# EAGLE design power_board (EAGLE 6.3)

## Sheet 1 of 7: V-AUX
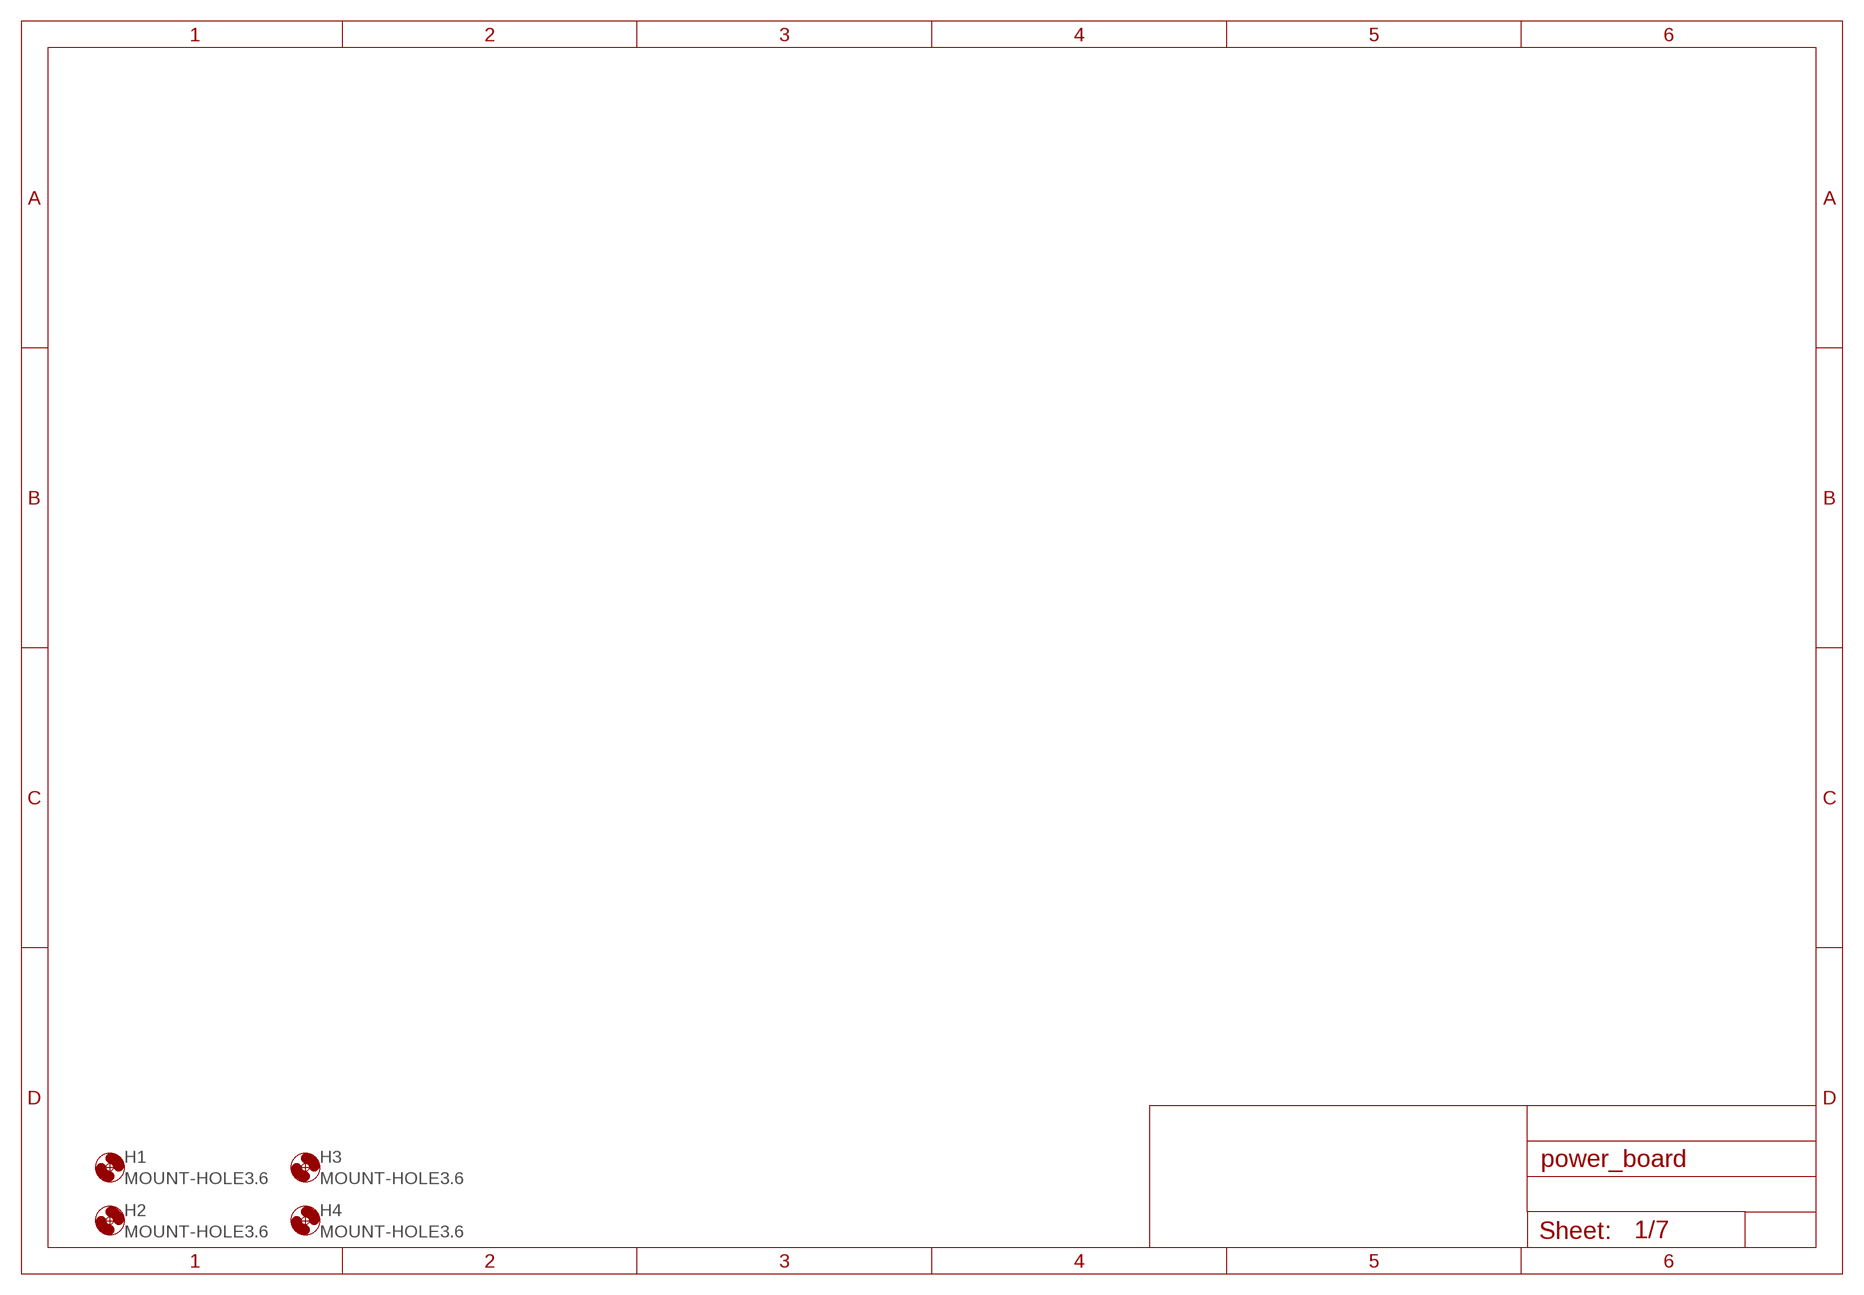
[diagram p0: schematic, sheet 1]

### Parts
H1  MOUNT-HOLE3.6  [3,6]
H2  MOUNT-HOLE3.6  [3,6]
H3  MOUNT-HOLE3.6  [3,6]
H4  MOUNT-HOLE3.6  [3,6]

## Sheet 2 of 7: 4S Li Charger
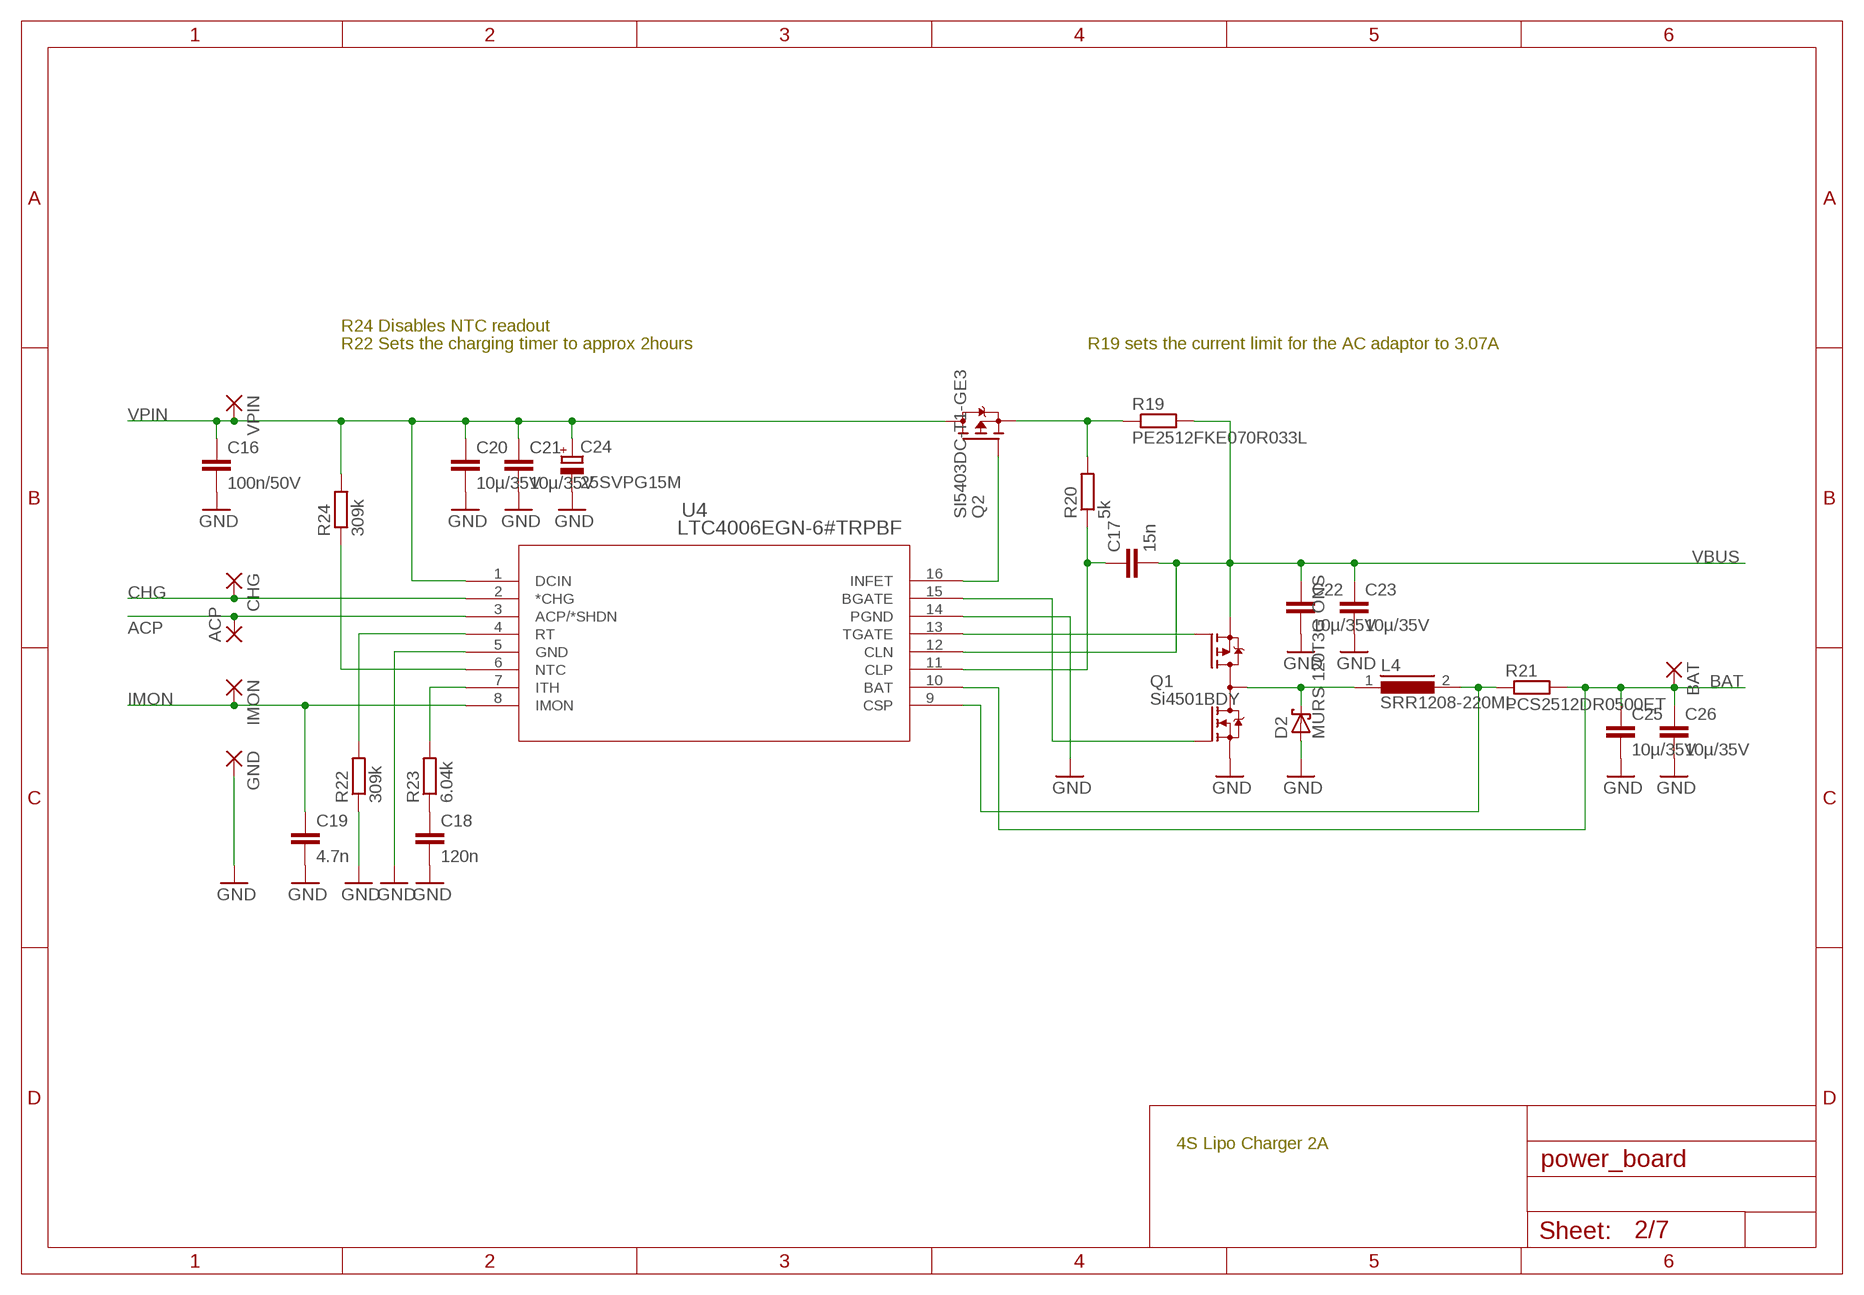
[diagram p1: schematic, sheet 2]

### Parts
ACP  SMD2  [SMD1,27-2,54]
BAT  SMD2  [SMD1,27-2,54]
C16  100n/50V  C-EUC1206  [C1206]
C17  15n  C-EUC0805  [C0805]
C18  120n  C-EUC0805  [C0805]
C19  4.7n  C-EUC0805  [C0805]
C20  10µ/35V  C-EUC1206  [C1206]
C21  10µ/35V  C-EUC1206  [C1206]
C22  10µ/35V  C-EUC1206  [C1206]
C23  10µ/35V  C-EUC1206  [C1206]
C24  25SVPG15M  CPOL-EU153CLV-0505  [153CLV-0505]
C25  10µ/35V  C-EUC1206  [C1206]
C26  10µ/35V  C-EUC1206  [C1206]
CHG  SMD2  [SMD1,27-2,54]
D2  MURS 120T3G ONS  SCHOTTKY-DIODESMD  [SMB]
GND  SMD2  [SMD1,27-2,54]
IMON  SMD2  [SMD1,27-2,54]
L4  SRR1208-220ML  DR127  [DR127]
Q1  Si4501BDY  IRF7389  [SO08-IRF]
Q2  SI5403DC-T1-GE3  [1206-8CHIP-FET]
R19  PE2512FKE070R033L  R-EU_R2512  [R2512]
R20  5k  R-EU_R0805  [R0805]
R21  PCS2512DR0500ET  R-EU_R2512  [R2512]
R22  309k  R-EU_R0805  [R0805]
R23  6.04k  R-EU_R0805  [R0805]
R24  309k  R-EU_R0805  [R0805]
U4  LTC4006EGN-6#TRPBF  [SSOP-16_GN]
VPIN  SMD2  [SMD1,27-2,54]

### Nets
ACP: ACP.1(P) U4.3(ACP/*SHDN)
BAT: BAT.1(P) C25.1 C26.1 R21.2 U4.10(BAT) ; also sheet 7
CHG: CHG.1(P) U4.2(*CHG)
GND: C16.2 C18.2 C19.2 C20.2 C21.2 C22.2 C23.2 C24.- C25.2 C26.2 D2.A GND.1(P) Q1.1(N-S) R22.1 U4.5(GND) U4.14(PGND) ; also sheet 3,4,5,6,7
IMON: C19.1 IMON.1(P) U4.8(IMON)
N$10: Q2.4(G) U4.16(INFET)
N$11: Q2.5(S) R19.1 R20.2
N$12: Q1.4(P-G) U4.13(TGATE)
N$13: Q1.2(N-G) U4.15(BGATE)
N$16: C17.1 R20.1 U4.11(CLP)
N$17: C18.1 R23.1
N$18: D2.C L4.1 Q1.5(D) Q1.6(D) Q1.7(D) Q1.8(D)
N$19: L4.2 R21.1 U4.9(CSP)
N$20: R22.2 U4.4(RT)
N$21: R23.2 U4.7(ITH)
N$23: R24.1 U4.6(NTC)
VBUS: C17.2 C22.1 C23.1 Q1.3(P-S) R19.2 U4.12(CLN) ; also sheet 3,4,5,6
VPIN: C16.1 C20.1 C21.1 C24.+ Q2.1(D) Q2.2(D) Q2.3(D) Q2.6(D) Q2.7(D) Q2.8(D) R24.2 U4.1(DCIN) VPIN.1(P) ; also sheet 7

### Notes on the sheet
- R24 Disables NTC readout
- R22 Sets the charging timer to approx 2hours | R19 sets the current limit for the AC adaptor to 3.07A
- 4S Lipo Charger 2A

## Sheet 3 of 7: D30U Boost
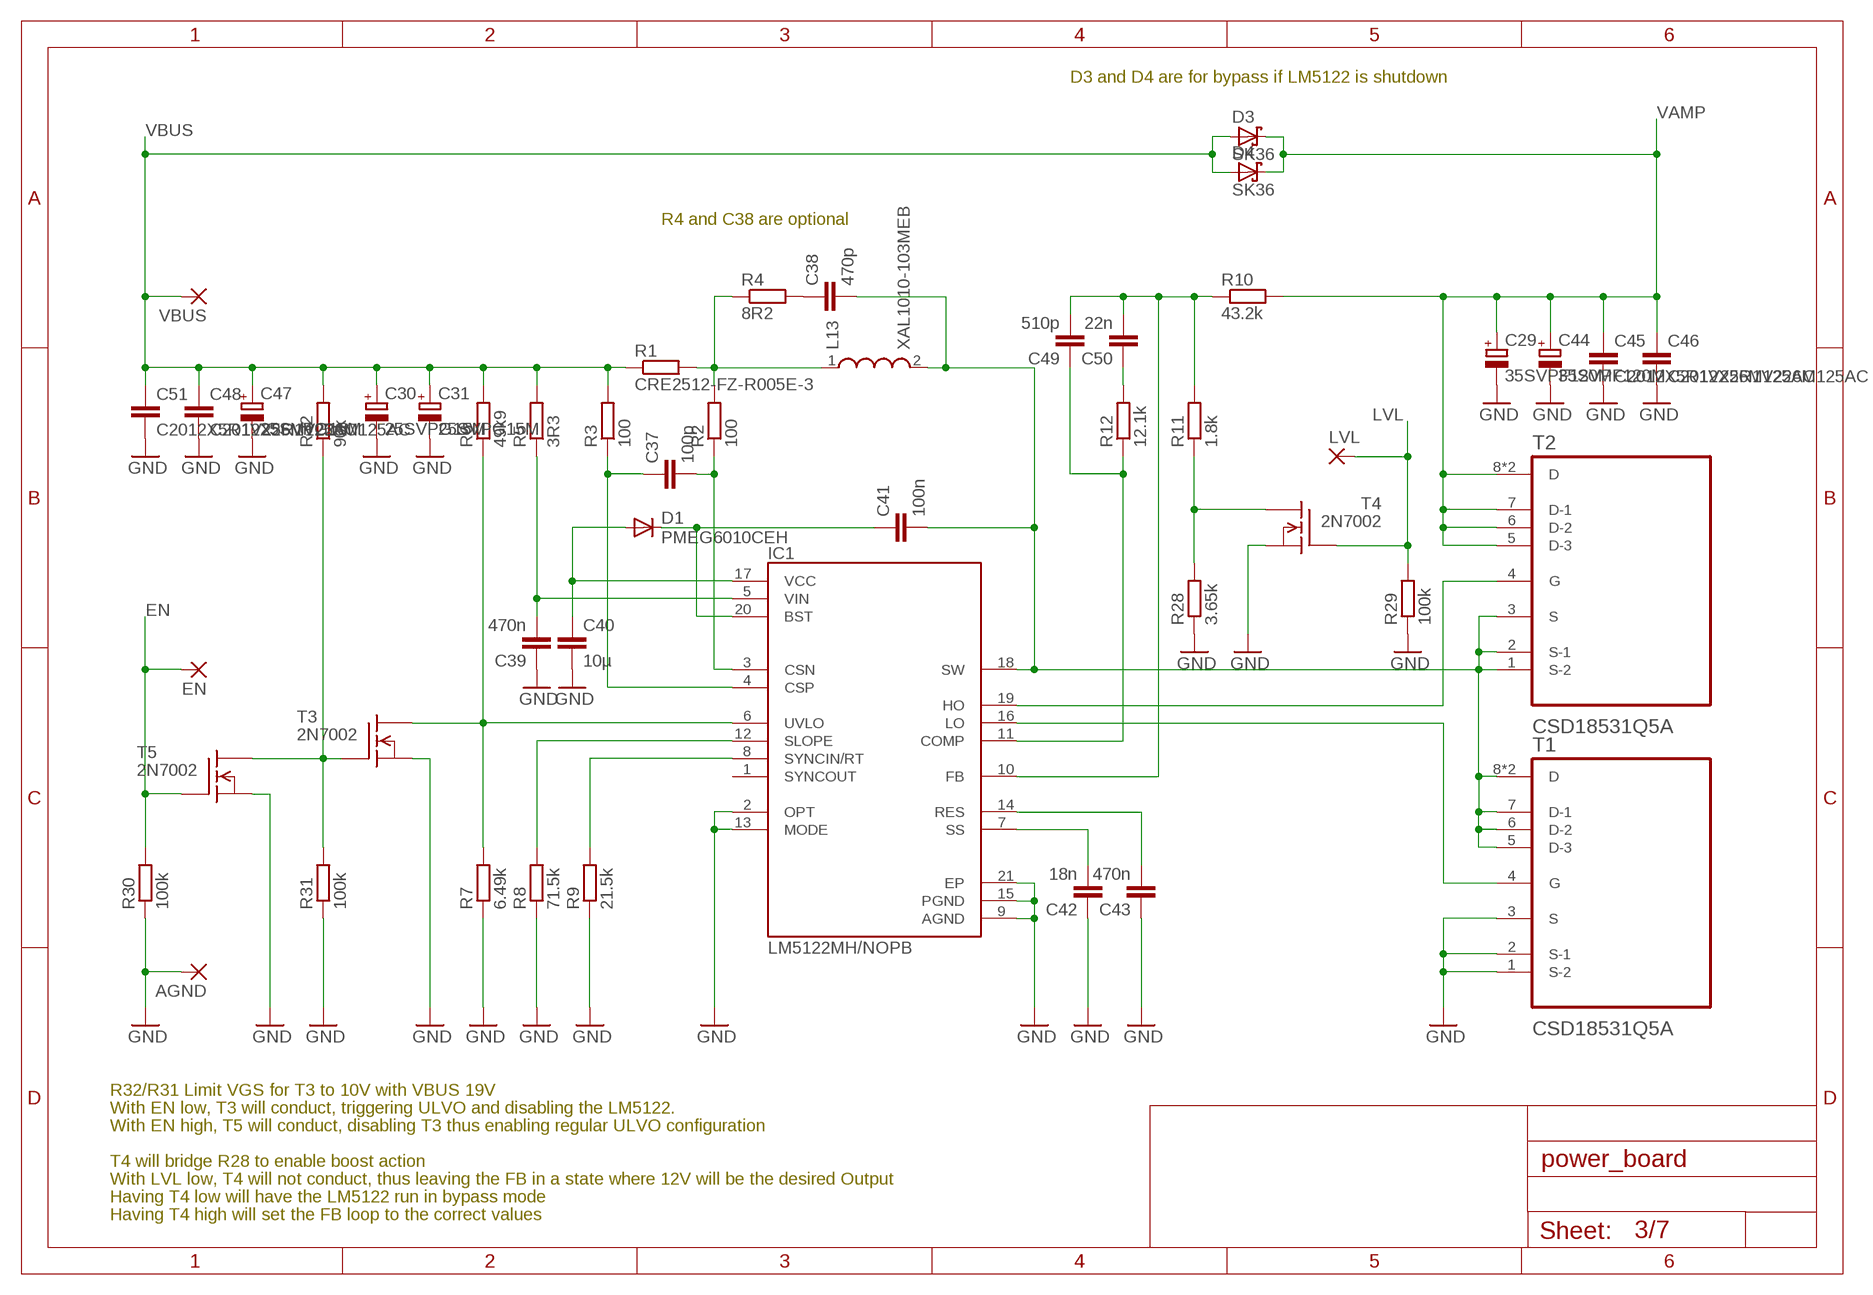
[diagram p2: schematic, sheet 3]

### Parts
AGND  SMD2  [SMD1,27-2,54]
C29  35SVPF120M  CPOL-EU153CLV-1012  [153CLV-1012]
C30  25SVPG15M  CPOL-EU153CLV-0505  [153CLV-0505]
C31  25SVPG15M  CPOL-EU153CLV-0505  [153CLV-0505]
C37  100p  C-EUC0805  [C0805]
C38  470p  C-EUC0805  [C0805]
C39  470n  C-EUC0805  [C0805]
C40  10µ  C-EUC1206  [C1206]
C41  100n  C-EUC0805  [C0805]
C42  18n  C-EUC0805  [C0805]
C43  470n  C-EUC0805  [C0805]
C44  35SVPF120M  CPOL-EU153CLV-1012  [153CLV-1012]
C45  C2012X5R1V226M125AC  C-EUC0805  [C0805]
C46  C2012X5R1V226M125AC  C-EUC0805  [C0805]
C47  25SVPG15M  CPOL-EU153CLV-0505  [153CLV-0505]
C48  C2012X5R1V226M125AC  C-EUC0805  [C0805]
C49  510p  C-EUC0805  [C0805]
C50  22n  C-EUC0805  [C0805]
C51  C2012X5R1V226M125AC  C-EUC0805  [C0805]
D1  PMEG6010CEH  DIODE-SOD323-W  [SOD323-W]
D3  SK36  SCHOTTKY-DIODESMD  [SMB]
D4  SK36  SCHOTTKY-DIODESMD  [SMB]
EN  SMD2  [SMD1,27-2,54]
IC1  LM5122MH/NOPB  [SOP65P640X110-21N]
L13  XAL1010-103MEB  XAL1010-472MED  [INDC110100X1000N]
LVL  SMD2  [SMD1,27-2,54]
R1  CRE2512-FZ-R005E-3  R-EU_R2512  [R2512]
R2  100  R-EU_R0805  [R0805]
R3  100  R-EU_R0805  [R0805]
R4  8R2  R-EU_M0805  [M0805]
R5  3R3  R-EU_R0805  [R0805]
R6  49k9  R-EU_R0805  [R0805]
R7  6.49k  R-EU_R0805  [R0805]
R8  71.5k  R-EU_R0805  [R0805]
R9  21.5k  R-EU_R0805  [R0805]
R10  43.2k  R-EU_R0805  [R0805]
R11  1.8k  R-EU_R0805  [R0805]
R12  12.1k  R-EU_R0805  [R0805]
R28  3.65k  R-EU_R0805  [R0805]
R29  100k  R-EU_R0805  [R0805]
R30  100k  R-EU_R0805  [R0805]
R31  100k  R-EU_R0805  [R0805]
R32  90k  R-EU_R0805  [R0805]
T1  CSD18531Q5A  [MOSFET_CSD19531Q5A]
T2  CSD18531Q5A  [MOSFET_CSD19531Q5A]
T3  2N7002  [SOT23]
T4  2N7002  [SOT23]
T5  2N7002  [SOT23]
VBUS  SMD2  [SMD1,27-2,54]

### Nets
EN: EN.1(P) R30.2 T5.1(G) ; also sheet 4,6,7
GND: AGND.1(P) C29.- C30.- C31.- C39.1 C40.2 C42.1 C43.1 C44.- C45.2 C46.2 C47.- C48.2 C51.2 IC1.2(OPT) IC1.9(AGND) IC1.13(MODE) IC1.15(PGND) IC1.21(EP) R7.1 R8.1 R9.1 R28.1 R29.1 R30.1 R31.1 T1.1(S-2) T1.2(S-1) T1.3(S) T3.2(S) T4.2(S) T5.2(S) ; also sheet 2,4,5,6,7
LVL: LVL.1(P) R29.2 T4.1(G) ; also sheet 7
N$22: R11.1 R28.2 T4.3(D)
N$25: R31.2 R32.1 T3.1(G) T5.3(D)
N$31: C38.2 C41.2 IC1.18(SW) L13.2 T1.5(D-3) T1.6(D-2) T1.7(D-1) T1.8(D) T1.9(D) T2.1(S-2) T2.2(S-1) T2.3(S)
N$32: C41.1 D1.C IC1.20(BST)
N$34: L13.1 R1.2 R2.2 R4.1
N$35: C38.1 R4.2
N$37: C37.2 IC1.3(CSN) R2.1
N$38: C37.1 IC1.4(CSP) R3.1
N$39: IC1.19(HO) T2.4(G)
N$40: IC1.16(LO) T1.4(G)
N$41: C39.2 IC1.5(VIN) R5.1
N$42: C40.1 D1.A IC1.17(VCC)
N$43: IC1.6(UVLO) R6.1 R7.2 T3.3(D)
N$44: IC1.12(SLOPE) R8.2
N$45: IC1.8(SYNCIN/RT) R9.2
N$46: C42.2 IC1.7(SS)
N$47: C43.2 IC1.14(RES)
N$48: C49.2 C50.2 IC1.10(FB) R10.1 R11.2
N$49: C50.1 R12.2
N$50: C49.1 IC1.11(COMP) R12.1
VAMP: C29.+ C44.+ C45.1 C46.1 D3.C D4.C R10.2 T2.5(D-3) T2.6(D-2) T2.7(D-1) T2.8(D) T2.9(D) ; also sheet 7
VBUS: C30.+ C31.+ C47.+ C48.1 C51.1 D3.A D4.A R1.1 R3.2 R5.2 R6.2 R32.2 VBUS.1(P) ; also sheet 2,4,5,6
Unconnected: IC1.1(SYNCOUT)

### Notes on the sheet
- D3 and D4 are for bypass if LM5122 is shutdown
- R4 and C38 are optional
- R32/R31 Limit VGS for T3 to 10V with VBUS 19V
- With EN low, T3 will conduct, triggering ULVO and disabling the LM5122.
- With EN high, T5 will conduct, disabling T3 thus enabling regular ULVO configuration
- T4 will bridge R28 to enable boost action
- With LVL low, T4 will not conduct, thus leaving the FB in a state where 12V will be the desired Output
- Having T4 low will have the LM5122 run in bypass mode
- Having T4 high will set the FB loop to the correct values

## Sheet 4 of 7: A75U Buck
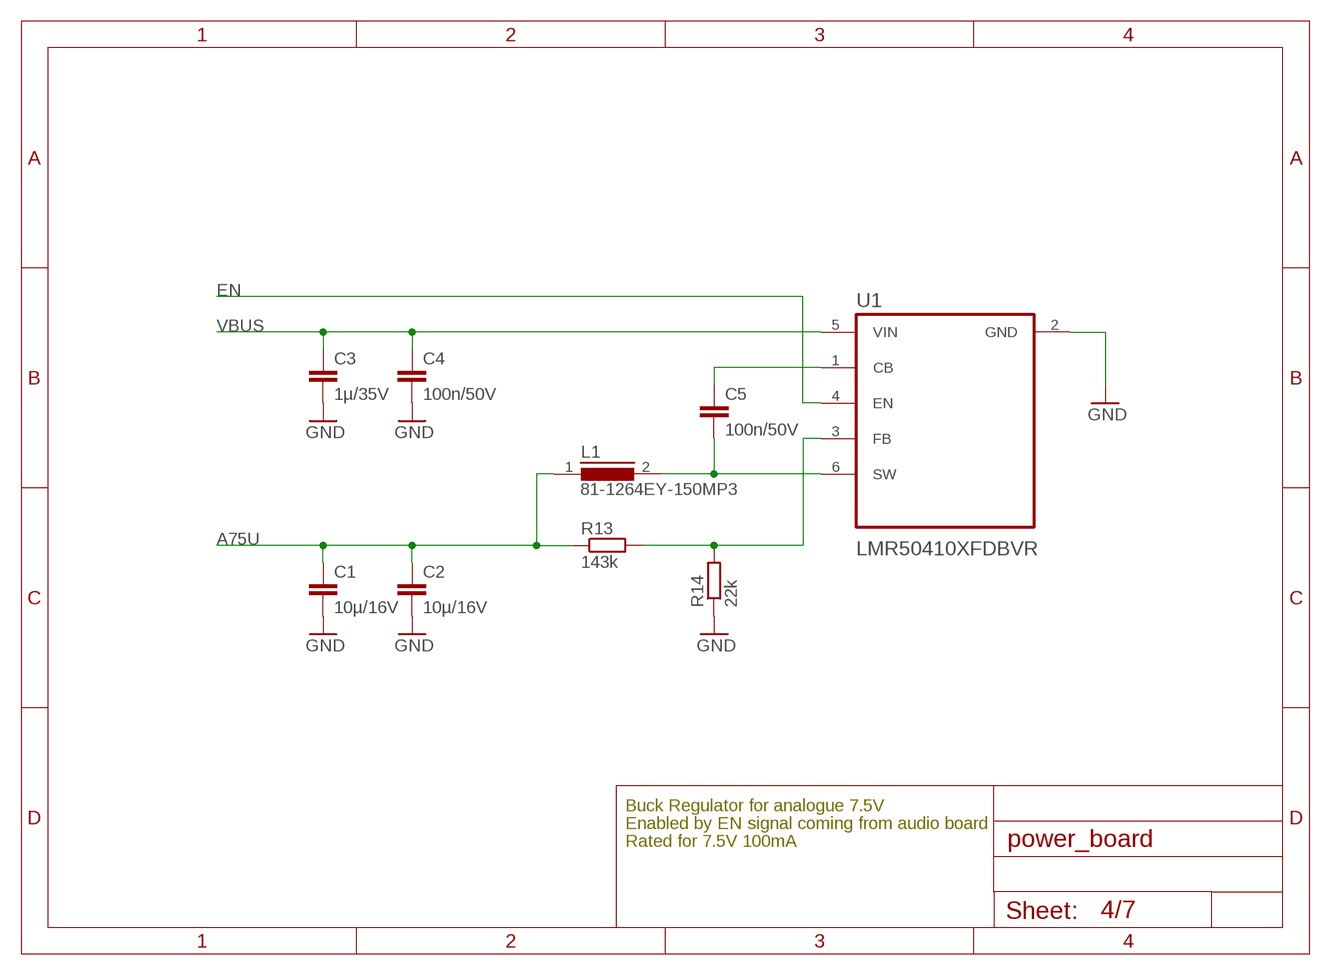
[diagram p3: schematic, sheet 4]

### Parts
C1  10µ/16V  C-EUC1206  [C1206]
C2  10µ/16V  C-EUC1206  [C1206]
C3  1µ/35V  C-EUC1206  [C1206]
C4  100n/50V  C-EUC1206  [C1206]
C5  100n/50V  C-EUC1206  [C1206]
L1  81-1264EY-150MP3  DR73  [DR73]
R13  143k  R-EU_M0805  [M0805]
R14  22k  R-EU_M0805  [M0805]
U1  LMR50410XFDBVR  TPS560430YDBVT  [SOT95P280X145-6N]

### Nets
A75U: C1.1 C2.1 L1.1 R13.1 ; also sheet 7
EN: U1.4(EN) ; also sheet 3,6,7
GND: C1.2 C2.2 C3.2 C4.2 R14.1 U1.2(GND) ; also sheet 2,3,5,6,7
N$1: C5.1 U1.1(CB)
N$2: C5.2 L1.2 U1.6(SW)
N$3: R13.2 R14.2 U1.3(FB)
VBUS: C3.1 C4.1 U1.5(VIN) ; also sheet 2,3,5,6

### Notes on the sheet
- Buck Regulator for analogue 7.5V
- Enabled by EN signal coming from audio board
- Rated for 7.5V 100mA

## Sheet 5 of 7: D33U Buck
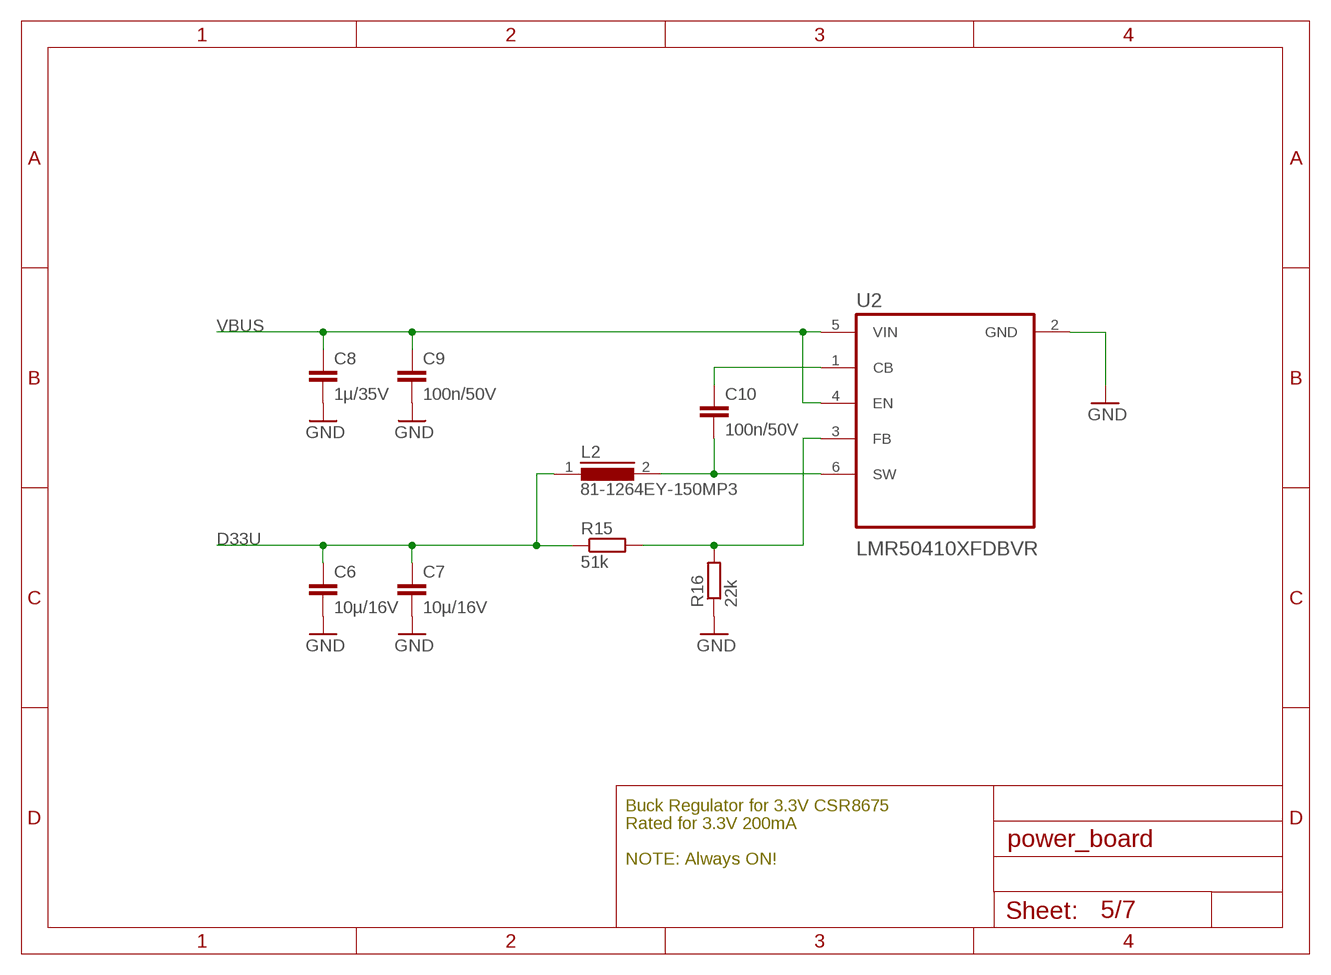
[diagram p4: schematic, sheet 5]

### Parts
C6  10µ/16V  C-EUC1206  [C1206]
C7  10µ/16V  C-EUC1206  [C1206]
C8  1µ/35V  C-EUC1206  [C1206]
C9  100n/50V  C-EUC1206  [C1206]
C10  100n/50V  C-EUC1206  [C1206]
L2  81-1264EY-150MP3  DR73  [DR73]
R15  51k  R-EU_M0805  [M0805]
R16  22k  R-EU_M0805  [M0805]
U2  LMR50410XFDBVR  TPS560430YDBVT  [SOT95P280X145-6N]

### Nets
D33U: C6.1 C7.1 L2.1 R15.1 ; also sheet 7
GND: C6.2 C7.2 C8.2 C9.2 R16.1 U2.2(GND) ; also sheet 2,3,4,6,7
N$4: C10.1 U2.1(CB)
N$5: C10.2 L2.2 U2.6(SW)
N$6: R15.2 R16.2 U2.3(FB)
VBUS: C8.1 C9.1 U2.4(EN) U2.5(VIN) ; also sheet 2,3,4,6

### Notes on the sheet
- Buck Regulator for 3.3V CSR8675
- Rated for 3.3V 200mA
- NOTE: Always ON!

## Sheet 6 of 7: D120U Buck
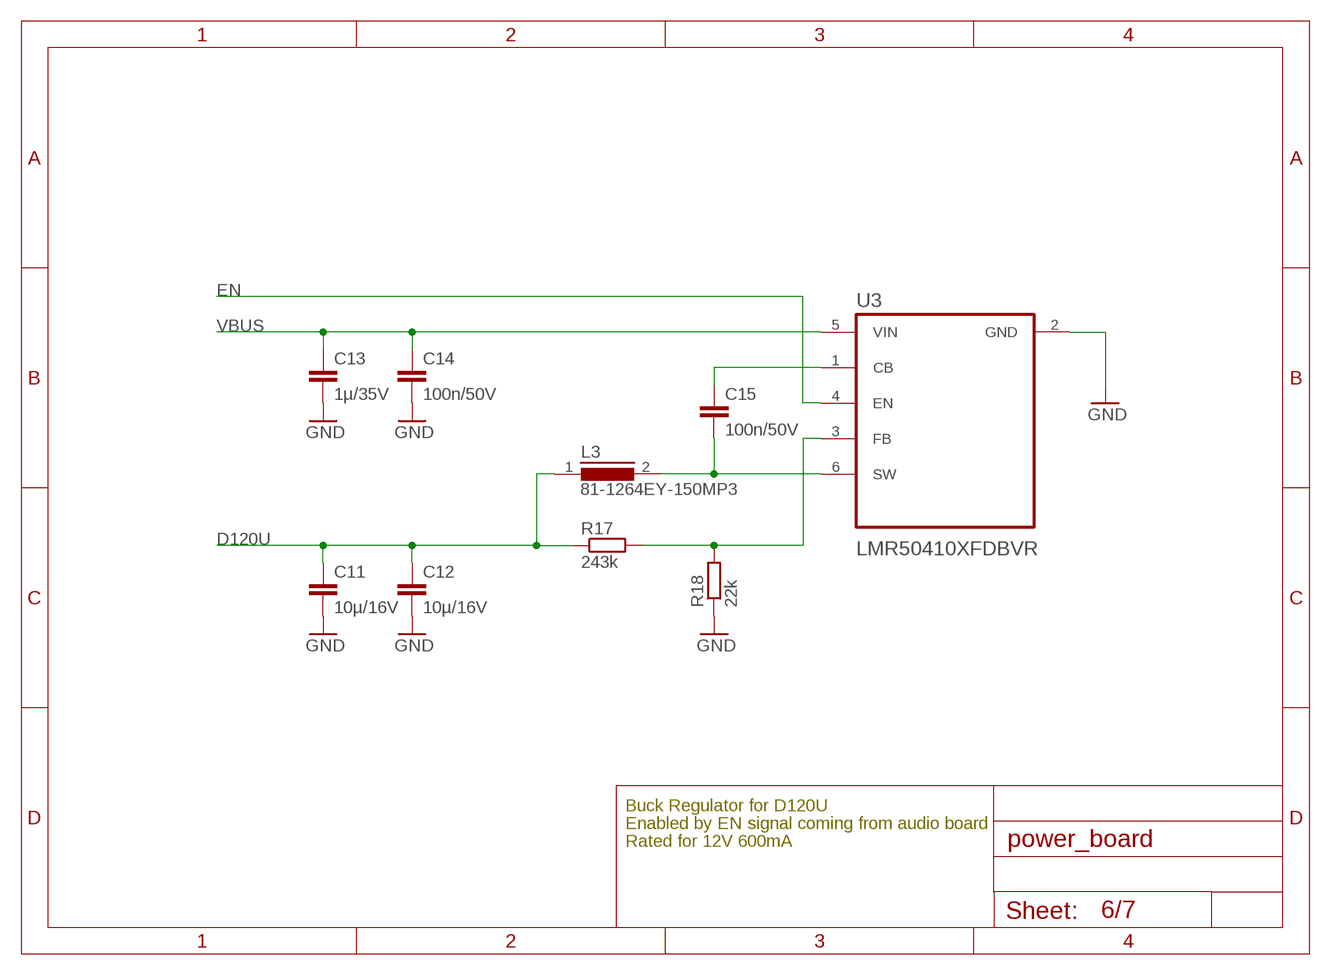
[diagram p5: schematic, sheet 6]

### Parts
C11  10µ/16V  C-EUC1206  [C1206]
C12  10µ/16V  C-EUC1206  [C1206]
C13  1µ/35V  C-EUC1206  [C1206]
C14  100n/50V  C-EUC1206  [C1206]
C15  100n/50V  C-EUC1206  [C1206]
L3  81-1264EY-150MP3  DR73  [DR73]
R17  243k  R-EU_M0805  [M0805]
R18  22k  R-EU_M0805  [M0805]
U3  LMR50410XFDBVR  TPS560430YDBVT  [SOT95P280X145-6N]

### Nets
D120U: C11.1 C12.1 L3.1 R17.1 ; also sheet 7
EN: U3.4(EN) ; also sheet 3,4,7
GND: C11.2 C12.2 C13.2 C14.2 R18.1 U3.2(GND) ; also sheet 2,3,4,5,7
N$7: C15.1 U3.1(CB)
N$8: C15.2 L3.2 U3.6(SW)
N$9: R17.2 R18.2 U3.3(FB)
VBUS: C13.1 C14.1 U3.5(VIN) ; also sheet 2,3,4,5

### Notes on the sheet
- Buck Regulator for D120U
- Enabled by EN signal coming from audio board
- Rated for 12V 600mA

## Sheet 7 of 7
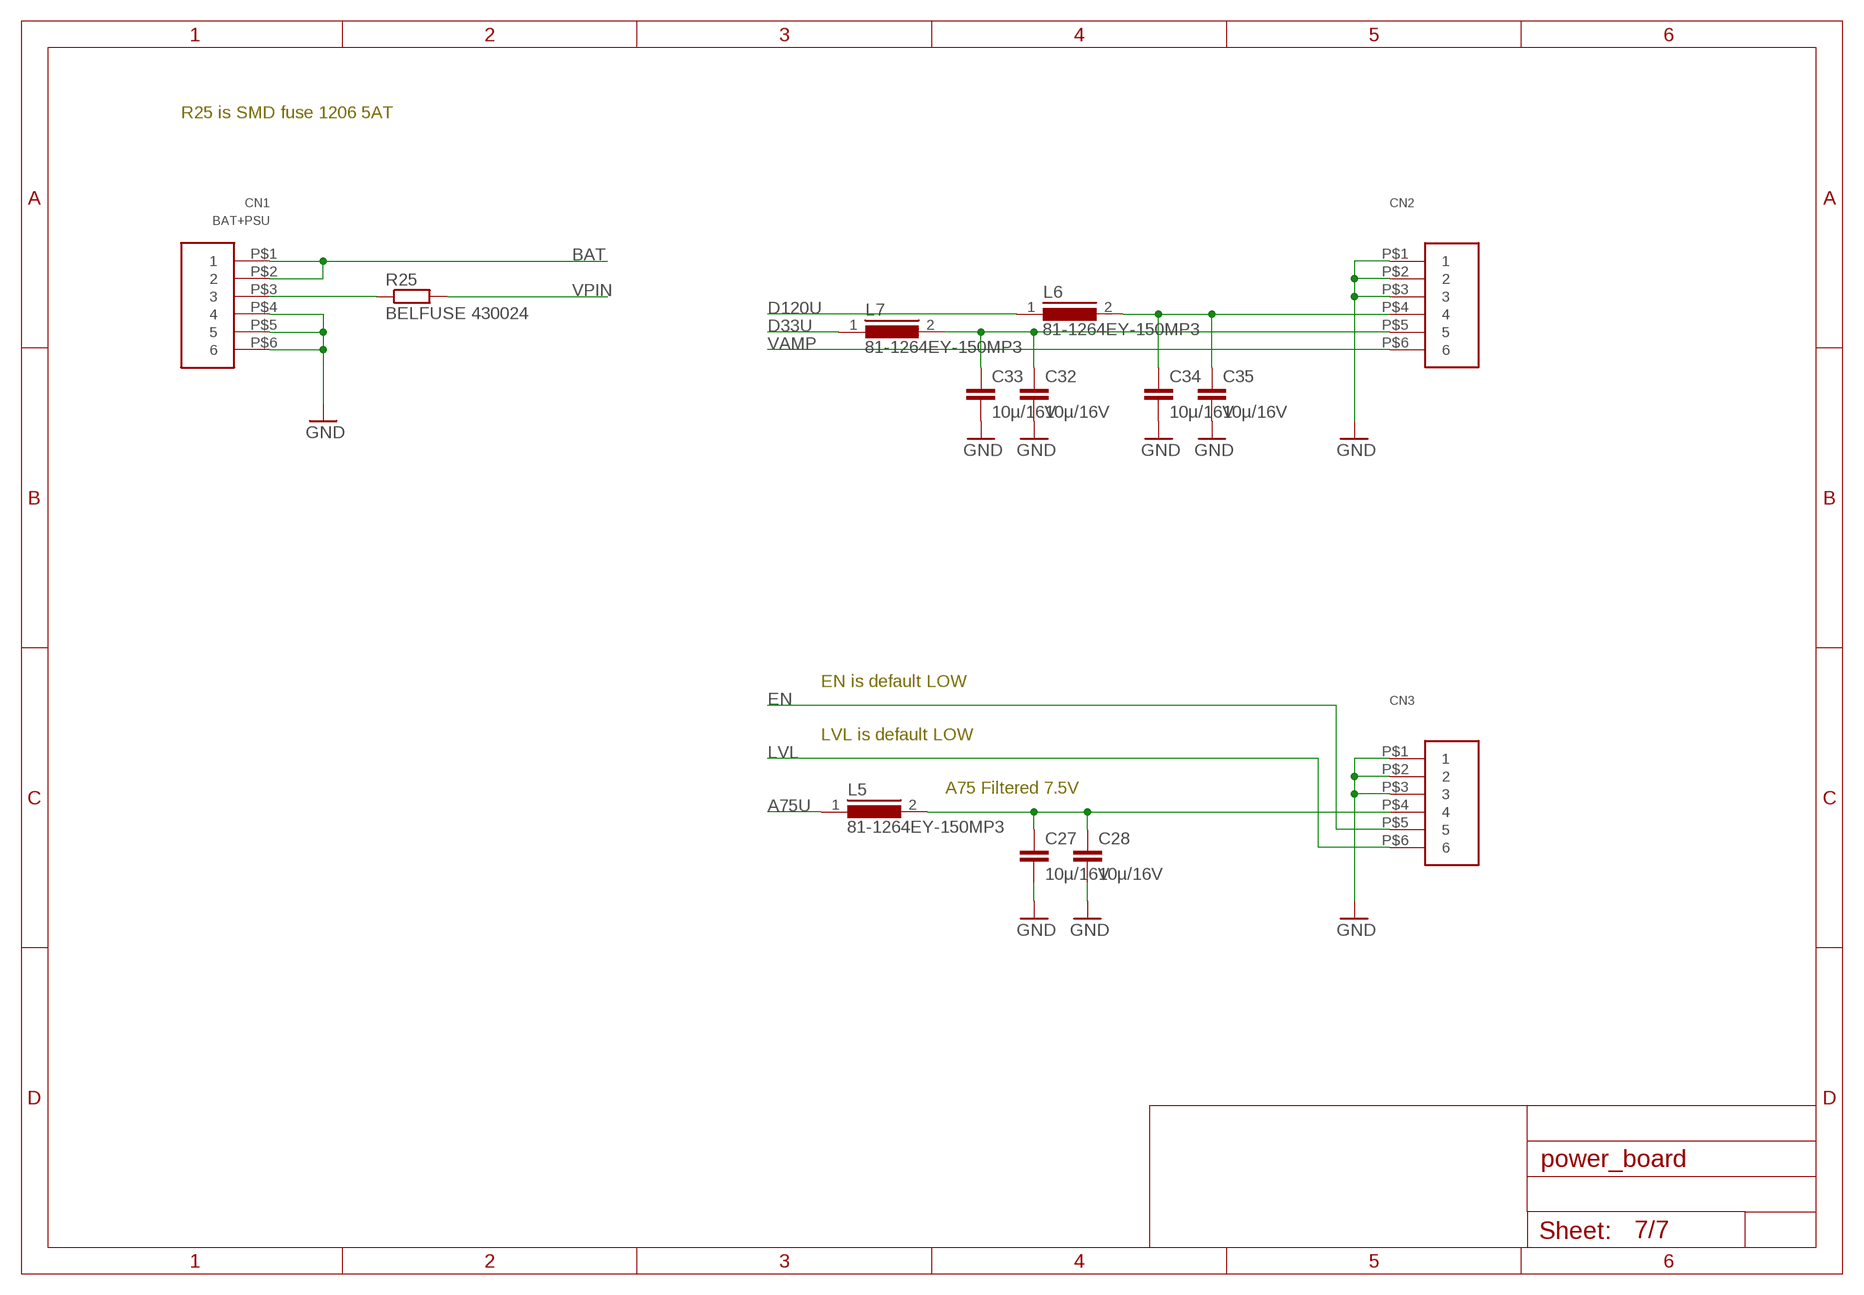
[diagram p6: schematic, sheet 7]

### Parts
C27  10µ/16V  C-EUC1206  [C1206]
C28  10µ/16V  C-EUC1206  [C1206]
C32  10µ/16V  C-EUC1206  [C1206]
C33  10µ/16V  C-EUC1206  [C1206]
C34  10µ/16V  C-EUC1206  [C1206]
C35  10µ/16V  C-EUC1206  [C1206]
CN1  BAT+PSU  39-30-1060_BLANK  [5569_6P]
CN2  39-30-1060_BLANK  [5569_6P]
CN3  39-30-1060_BLANK  [5569_6P]
L5  81-1264EY-150MP3  DR73  [DR73]
L6  81-1264EY-150MP3  DR73  [DR73]
L7  81-1264EY-150MP3  DR73  [DR73]
R25  BELFUSE 430024  R-EU_R1206W  [R1206W]

### Nets
A75U: L5.1 ; also sheet 4
BAT: CN1.P$1 CN1.P$2 ; also sheet 2
D33U: L7.1 ; also sheet 5
D120U: L6.1 ; also sheet 6
EN: CN3.P$5 ; also sheet 3,4,6
GND: C27.2 C28.2 C32.2 C33.2 C34.2 C35.2 CN1.P$4 CN1.P$5 CN1.P$6 CN2.P$1 CN2.P$2 CN2.P$3 CN3.P$1 CN3.P$2 CN3.P$3 ; also sheet 2,3,4,5,6
LVL: CN3.P$6 ; also sheet 3
N$14: CN1.P$3 R25.1
N$15: C27.1 C28.1 CN3.P$4 L5.2
N$24: C34.1 C35.1 CN2.P$4 L6.2
N$26: C32.1 C33.1 CN2.P$5 L7.2
VAMP: CN2.P$6 ; also sheet 3
VPIN: R25.2 ; also sheet 2

### Notes on the sheet
- R25 is SMD fuse 1206 5AT
- EN is default LOW
- LVL is default LOW
- A75 Filtered 7.5V

## Library data of the parts
ACP AGND BAT CHG EN GND IMON LVL VBUS VPIN = wirepad:SMD2: SMD PAD
C1-C23 C25-C28 C32-C35 C37-C43 C45 C46 C48-C51 = rcl:C-EU: CAPACITOR, European symbol
C24 C29-C31 C44 C47 = rcl:CPOL-EU: POLARIZED CAPACITOR, European symbol
CN1-CN3 = molex-con-39301060:39-30-1060_BLANK
D1 = diode:DIODE-: DIODE
D2-D4 = diode:SCHOTTKY-DIODE: Schottky Diode
H1-H4 = holes:MOUNT-HOLE: MOUNTING HOLE with drill center marker
IC1 = LM5122MH_NOPB:LM5122MH/NOPB: 3-65V Wide Vin, Current Mode Synchronous Boost Controller with Multiphase Capability Check prices <https://pricing.snapeda.com/search/part/LM5122MH/NOPB/?ref=eda>; AVAILABILITY: Good; DESCRIPTION: 3-65V Wide Vin, Current Mode Synchronous Boost Controller with Multiphase Capability 20-HTSSOP -40 to 125; MF: Texas Instruments; MP: LM5122MH/NOPB; PACKAGE: HTSSOP-20 Texas Instruments; PRICE: None; PURCHASE-URL: https://pricing.snapeda.com/search/part/LM5122MH/NOPB/?ref=eda
L1-L3 L5-L7 = inductors:DR73: High Power Density, High Efficiency, Shielded Inductors Source: coiltronics_dr_series.pdf
L4 = inductors:DR127: High Power Density, High Efficiency, Shielded Inductors Source: coiltronics_dr_series.pdf
L13 = XAL1010-472MED:XAL1010-472MED: Power inductor, shielded, 20% tol, SMT, RoHS, halogen f Check prices <https://pricing.snapeda.com/parts/XAL1010-472MED/Coilcraft/view-part?ref=eda>; AVAILABILITY: Warning; DESCRIPTION: Power inductor, shielded, 20% tol, SMT, RoHS, halogen f; MF: Coilcraft; MP: XAL1010-472MED; PACKAGE: None; PRICE: None; PURCHASE-URL: https://pricing.snapeda.com/search/part/XAL1010-472MED/?ref=eda
Q1 = transistor-fet:IRF7389: Complimentary Half Bridge HEXFET Power MOSFET Source: http://www.irf.com/product-info/datasheets/data/irf7389.pdf
Q2 = transistor-fet:SI5403DC-T1-GE3
R1-R25 R28-R32 = rcl:R-EU_: RESISTOR, European symbol
T1 T2 = CSD18531Q5A:CSD18531Q5A: Check prices <https://pricing.snapeda.com/search/part/CSD18531Q5A/?ref=eda>; AVAILABILITY: Good; DESCRIPTION: 60V, N ch NexFET MOSFET, single SON5x6, 4.6mOhm 8-VSONP -55 to 150; MF: Texas Instruments; MP: CSD18531Q5A; PACKAGE: VSONP-8 Texas Instruments; PRICE: None; PURCHASE-URL: https://pricing.snapeda.com/search/part/CSD18531Q5A/?ref=eda
T3-T5 = parts:2N7002: N-CHANNEL ENHANCEMENT MODE FIELD EFFECT TRANSISTOR
U1-U3 = TPS560430YDBVT:TPS560430YDBVT: Check prices <https://pricing.snapeda.com/parts/TPS560430YDBVT/Texas%20Instruments/view-part?ref=eda>; AVAILABILITY: Good; DESCRIPTION: SIMPLE SWITCHER 36-V, 600-mA Buck Regulator With High-Efficiency Sleep Mode 6-SOT-23 -40 to 125; MF: Texas Instruments; MP: TPS560430YDBVT; PACKAGE: SOT-23-6 Texas Instruments; PRICE: None; PURCHASE-URL: https://pricing.snapeda.com/search/part/TPS560430YDBVT/?ref=eda
U4 = LTC4006EGN-6_TRPBF:LTC4006EGN-6#TRPBF: Check prices <https://pricing.snapeda.com/parts/LTC4006EGN-6%23TRPBF/Analog%20Devices/view-part?ref=eda>; AVAILABILITY: Warning; DESCRIPTION: Battery Charger Li-Ion 4000mA 8.4V 16-Pin SSOP N T/R; MF: Analog Devices; MP: LTC4006EGN-6#TRPBF; PACKAGE: SSOP -16 Analog Devices; PRICE: None

## Board
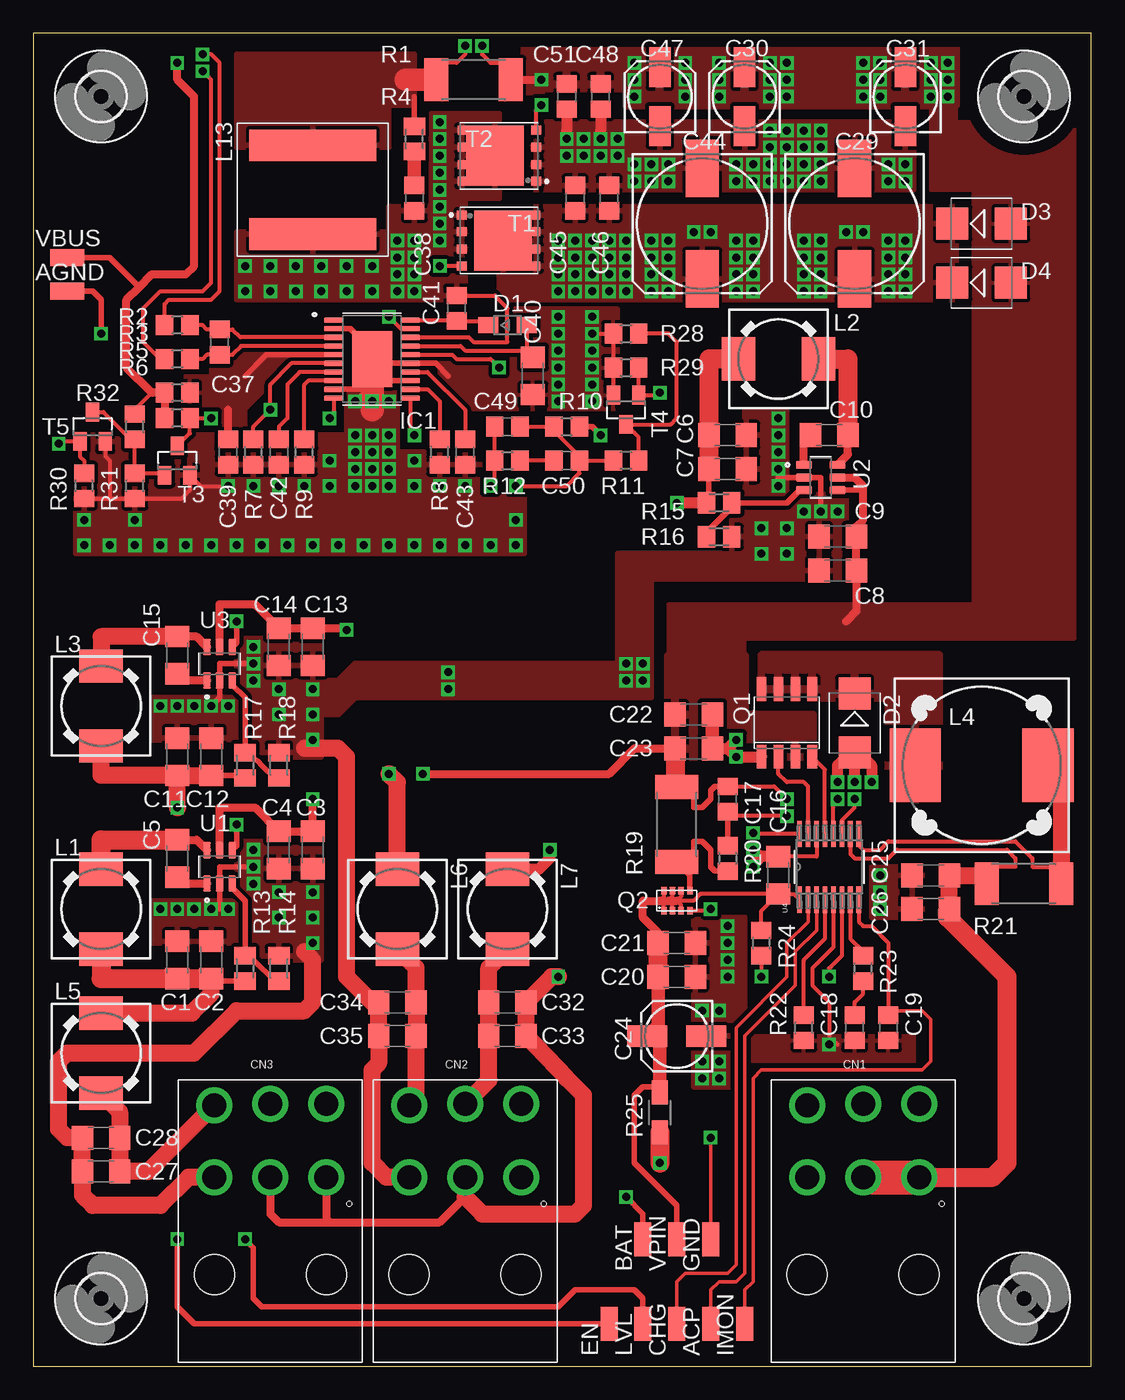
[diagram p7: board, top side]
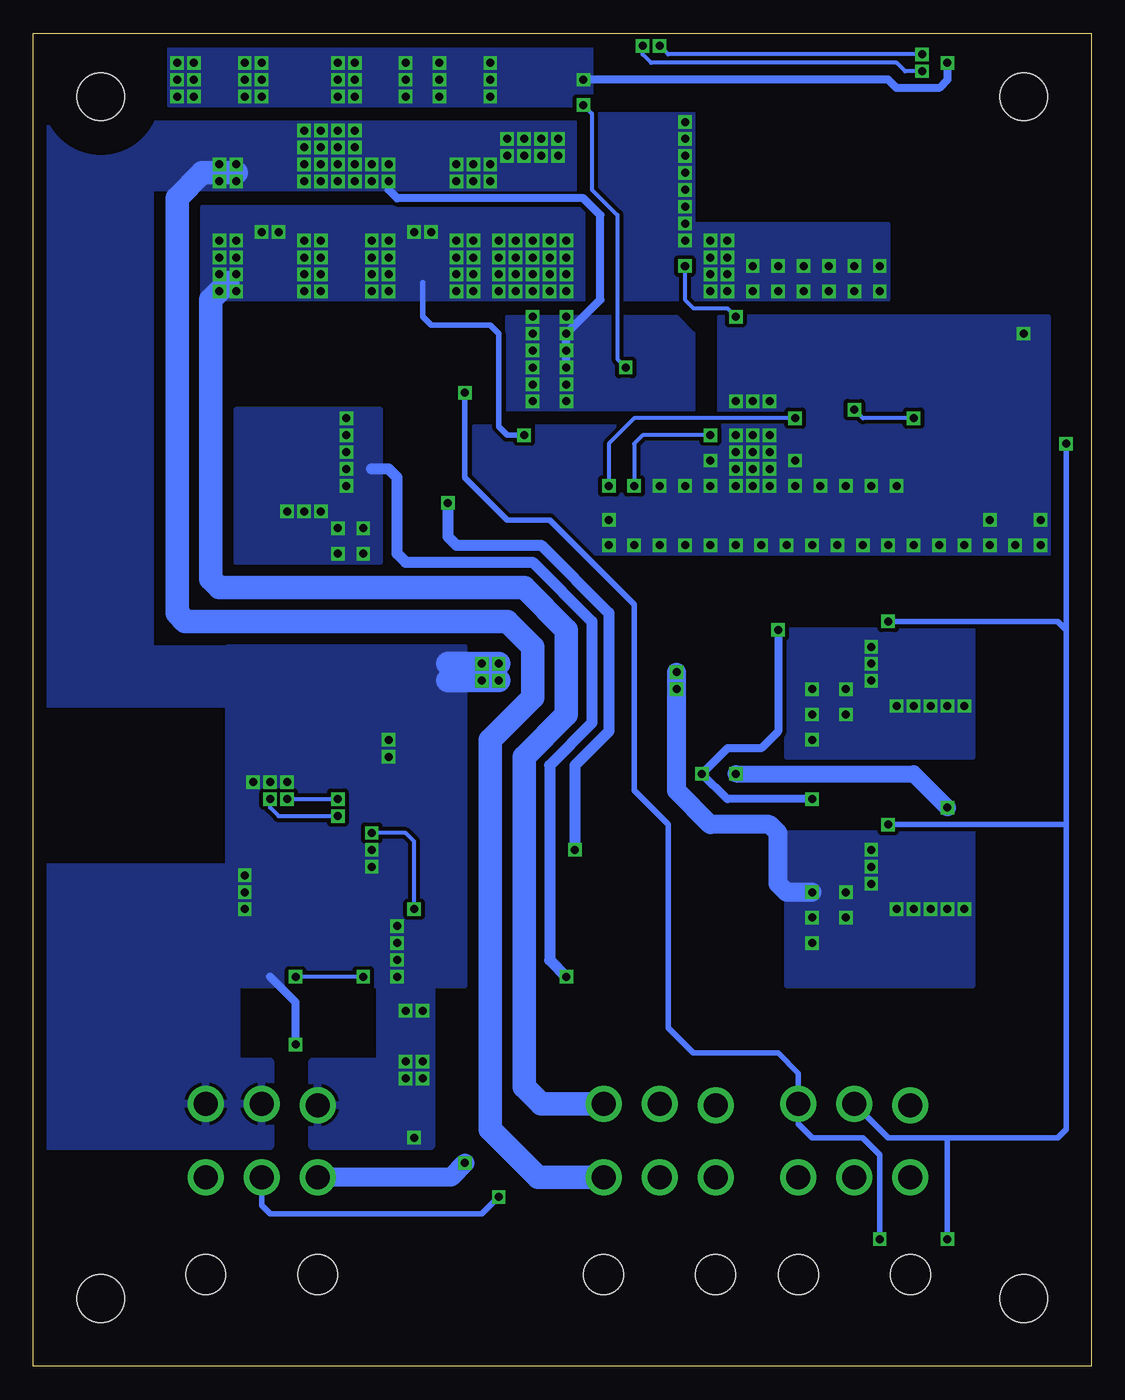
[diagram p8: board, bottom side, seen from below]

Size 79.36 x 100 mm. Coordinates in mm from the lower left corner, seen from the top.
Outline: 0,0 79.36,0 79.36,100 0,100 0,0
Copper layers (1*16): Top 0.035mm / dielectric 1.5mm / Bottom 0.035mm
Design rules "default": minimum track width 10mil, minimum drill 24mil, track to track 8mil, track to pad 8mil, pad to pad 8mil, via to via 8mil, smd to smd 8mil, copper to edge 40mil, drill to drill 8mil, minimum pad ring 10mil, minimum via ring 8mil, stop-mask expansion 4mil, vias tented up to drill 0mil, thermal gap 10mil

### Footprints (pad centres in the part's own frame; a part is rotated, then mirrored left to right if it is on the bottom)
SMD1,27-2,54 = smd 1.27 x 2.54: 1 0,0
C1206 = smd 1.6 x 1.8: 1 -1.4,0; 2 1.4,0
C0805 = smd 1.3 x 1.5: 1 -0.95,0; 2 0.95,0
153CLV-0505 = smd 3 x 1.6: + 2.2,0; - -2.2,0
153CLV-1012 = smd 4.3 x 2.5: + 4.15,0; - -4.15,0
5569_6P = drill 1.8: P$1 4.2,-5.5; P$2 0,-5.5; P$3 -4.2,-5.5; P$4 -4.2,-0.1; P$5 0,0; P$6 4.2,0 | hole 3: 4.2,-12.8; -4.2,-12.8
SOD323-W = smd 1.5 x 1.2: A 1.45,0; C -1.45,0
SMB = smd 2.4 x 2.4: A 2.2,0; C -2.2,0
3,6 = hole 3.6: 0,0
SOP65P640X110-21N = smd 1.44 x 0.41: 1 -2.885,2.925; 2 -2.885,2.275; 3 -2.885,1.625; 4 -2.885,0.975; 5 -2.885,0.325; 6 -2.885,-0.325; 7 -2.885,-0.975; 8 -2.885,-1.625; 9 -2.885,-2.275; 10 -2.885,-2.925; 11 2.885,-2.925; 12 2.885,-2.275; 13 2.885,-1.625; 14 2.885,-0.975; 15 2.885,-0.325; 16 2.885,0.325; 17 2.885,0.975; 18 2.885,1.625; 19 2.885,2.275; 20 2.885,2.925 | smd 3 x 4.2: 21 0,0
DR73 = smd 2.5 x 3.25: 1 -3,0; 2 3,0
DR127 = smd 3.85 x 5.5: 1 -4.975,0; 2 4.975,0
INDC110100X1000N = smd 2.38 x 9.51: 1 -3.325,0; 2 3.325,0
SO08-IRF = smd 0.72 x 1.78: 1 -1.905,-2.543; 2 -0.635,-2.543; 3 0.635,-2.543; 4 1.905,-2.543; 5 1.905,2.543; 6 0.635,2.543; 7 -0.635,2.543; 8 -1.905,2.543
1206-8CHIP-FET = smd 0.406 x 0.56: 1 -0.975,-0.737; 2 -0.325,-0.737; 3 0.325,-0.737; 4 0.975,-0.737; 5 0.975,0.737; 6 0.325,0.737; 7 -0.325,0.737; 8 -0.975,0.737
R2512 = smd 1.8 x 3.2: 1 -2.8,0; 2 2.8,0
R0805 = smd 1.3 x 1.5: 1 -0.95,0; 2 0.95,0
M0805 = smd 1.3 x 1.6: 1 -0.95,0; 2 0.95,0
R1206W = smd 1.8 x 1.2: 1 -1.499,0; 2 1.499,0
MOSFET_CSD19531Q5A = smd 0.75 x 0.675: 1 -2.776,1.917; 2 -2.776,0.66; 3 -2.776,-0.66; 4 -2.776,-1.917 | smd 0.655 x 0.675: 5 2.776,-1.917; 6 2.776,-0.66; 7 2.776,0.66; 8 2.776,1.917 | smd 4.295 x 4.51: 9 0.301,0
SOT23 = smd 1 x 1.4: 1 -0.95,-1.1; 2 0.95,-1.1; 3 0,1.1
SOT95P280X145-6N = smd 1.21 x 0.58: 1 -1.255,0.95; 2 -1.255,0; 3 -1.255,-0.95; 4 1.255,-0.95; 5 1.255,0; 6 1.255,0.95
SSOP-16_GN = smd 1.981 x 0.356: 1 -2.464,2.223; 2 -2.464,1.587; 3 -2.464,0.953; 4 -2.464,0.318; 5 -2.464,-0.318; 6 -2.464,-0.953; 7 -2.464,-1.587; 8 -2.464,-2.223; 9 2.464,-2.223; 10 2.464,-1.587; 11 2.464,-0.953; 12 2.464,-0.318; 13 2.464,0.318; 14 2.464,0.953; 15 2.464,1.587; 16 2.464,2.223

### Placement (x,y rotation side)
ACP  50.8,3.17 0 top
AGND  2.54,80.64 270 top
BAT  45.72,9.53 0 top
C1  10.79,30.48 90 top
C2  13.34,30.48 90 top
C3  20.95,38.73 270 top
C4  18.41,38.73 270 top
C5  10.79,38.1 90 top
C6  52.07,69.85 0 top
C7  52.07,67.31 0 top
C8  60.33,59.69 180 top
C9  60.33,62.23 180 top
C10  59.69,69.85 0 top
C11  10.79,45.72 90 top
C12  13.34,45.72 90 top
C13  20.95,53.98 270 top
C14  18.41,53.98 270 top
C15  10.79,53.34 90 top
C16  55.88,36.83 90 top
C17  52.07,42.55 90 top
C18  61.59,25.4 270 top
C19  64.14,25.4 270 top
C20  48.26,29.21 0 top
C21  48.26,31.75 0 top
C22  49.53,48.9 0 top
C23  49.53,46.35 0 top
C24  48.26,24.77 180 top
C25  67.31,36.83 180 top
C26  67.31,34.29 180 top
C27  5.08,14.61 180 top
C28  5.08,17.14 180 top
C29  61.59,85.72 270 top
C30  53.34,95.25 90 top
C31  65.41,95.25 90 top
C32  35.56,27.3 0 top
C33  35.56,24.77 0 top
C34  27.3,27.3 180 top
C35  27.3,24.77 180 top
C37  13.97,76.83 90 top
C38  28.57,87.63 270 top
C39  14.61,68.58 90 top
C40  37.47,74.3 270 top
C41  31.75,79.38 90 top
C42  18.41,68.58 90 top
C43  32.38,68.58 90 top
C44  50.16,85.72 270 top
C45  40.64,87.63 90 top
C46  43.18,87.63 90 top
C47  46.99,95.25 90 top
C48  42.55,95.25 270 top
C49  35.56,70.48 0 top
C50  40.01,67.94 0 top
C51  40.01,95.25 270 top
CHG  48.26,3.17 0 top
CN1  62.23,19.68 0 top
CN2  32.38,19.68 0 top
CN3  17.78,19.68 0 top
D1  35.56,78.11 0 top
D2  61.59,48.26 270 top
D3  71.12,85.72 0 top
D4  71.12,81.28 0 top
EN  43.18,3.17 0 top
GND  50.8,9.53 0 top
H1  5.08,5.08 0 top
H2  74.3,5.08 0 top
H3  74.3,95.25 0 top
H4  5.08,95.25 0 top
IC1  25.4,75.56 0 top
IMON  53.34,3.17 0 top
L1  5.08,34.29 90 top
L2  55.88,75.56 0 top
L3  5.08,49.53 90 top
L4  71.12,45.09 0 top
L5  5.08,23.5 270 top
L6  27.3,34.29 270 top
L7  35.56,34.29 270 top
L13  20.95,88.27 270 top
LVL  45.72,3.17 0 top
Q1  56.52,48.26 0 top
Q2  48.26,34.92 0 top
R1  33.02,96.52 180 top
R2  10.79,78.11 180 top
R3  10.79,75.56 180 top
R4  28.57,92.08 270 top
R5  10.79,73.03 180 top
R6  10.79,71.12 180 top
R7  16.51,68.58 90 top
R8  30.48,68.58 90 top
R9  20.32,68.58 90 top
R10  40.01,70.48 0 top
R11  44.45,67.94 180 top
R12  35.56,67.94 0 top
R13  15.88,29.84 90 top
R14  18.41,29.84 270 top
R15  51.44,64.77 0 top
R16  51.44,62.23 180 top
R17  15.88,45.09 90 top
R18  18.41,45.09 270 top
R19  48.26,40.64 90 top
R20  52.07,38.1 270 top
R21  74.3,36.2 180 top
R22  57.78,25.4 90 top
R23  62.23,29.84 90 top
R24  54.61,31.75 90 top
R25  46.99,19.05 90 top
R28  44.45,77.47 0 top
R29  44.45,74.93 0 top
R30  3.81,66.04 90 top
R31  7.62,66.04 90 top
R32  7.62,70.48 90 top
T1  34.92,90.81 180 top
T2  34.92,84.45 0 top
T3  10.79,67.94 0 top
T4  44.45,71.75 180 top
T5  4.45,70.48 0 top
U1  13.97,37.47 90 top
U2  59.05,66.67 0 top
U3  13.97,52.7 90 top
U4  59.69,37.47 90 top
VBUS  2.54,83.19 270 top
VPIN  48.26,9.53 0 top

### Tracks (layer width: path | path; a pad name or v marks a point on that pad's centre or on a via)
A75U
  Top 0.406: R13.1 13.52,28.89 C2.1
  Top 1.27: L5.1 11.89,26.5 13.34,27.94 C2.1
  Top 1.422: L1.1 5.08,29.08 C1.1 C2.1
ACP
  Top 0.254: ACP.1 50.8,5.71 51.44,6.35 52.7,6.35 53.34,6.99 53.34,24.77 57.15,28.57 57.15,31.11 58.74,32.7 U4.3
BAT  (via drill 0.6)
  Top 0.305: U4.10 61.28,38.42 61.59,38.1 64.14,38.1 64.77,38.73 73.03,38.73 73.66,38.1 73.66,37.47 71.75,37.47 71.12,37.47 71.12,36.57 R21.2
  Top 0.406: 71.75,36.83 71.75,37.47 | BAT.1 45.72,11.43 v44.45,12.7
  Top 1.27: C26.1 C25.1 71.75,36.83
  Top 1.422: CN1.P$1 71.97,14.19 73.03,15.24 73.03,29.21 68.58,33.66 68.58,34.16 C26.1
  Top 2.54: CN1.P$2 CN1.P$1
  Bottom 0.406: v44.45,12.7 45.72,11.43 61.59,11.43 62.23,12.06 CN1.P$2
CHG
  Top 0.254: CHG.1 48.26,6.35 48.9,6.99 52.07,6.99 52.7,7.62 52.7,25.4 56.52,29.21 56.52,31.75 58.1,33.34 U4.2
D33U  (via drill 0.6)
  Top 0.406: R15.1 50.67,64.77 C7.1
  Top 0.813: R15.1 v48.26,64.77 | L7.1 37.92,37.29 38.73,38.1 v38.73,38.73
  Top 1.422: L2.1 50.67,75.56 C6.1 C7.1
  Bottom 0.813: v48.26,64.77 48.26,62.23 47.62,61.59 41.27,61.59 36.2,56.52 36.2,47.62 38.73,45.09 v38.73,38.73
D120U  (via drill 0.6)
  Top 0.406: C12.1 15.88,44.32 R17.1
  Top 1.27: C11.1 5.08,44.32 L3.1 | C11.1 C12.1 | L6.1 27.3,43.81 v26.67,44.45 | v10.79,41.91 C11.1
  Bottom 1.27: v26.67,44.45 13.34,44.45 v10.79,41.91
EN  (via drill 0.6)
  Top 0.305: R30.2 3.81,67.94 3.5,68.26 T5.1 2.08,69.39 v1.91,69.22
  Top 0.406: v15.24,40.64 15.24,39.04 U1.4 | U3.4 15.24,54.28 v15.24,55.88 | EN.1 12.06,3.17 10.79,4.45 v10.79,9.53
  Bottom 0.406: v15.24,55.88 2.54,55.88 1.91,55.24 | 1.91,55.24 v1.91,69.22 | 1.91,55.24 1.91,40.64 | 1.91,40.64 1.91,17.78 2.54,17.14 10.79,17.14 | 10.79,17.14 15.24,17.14 CN3.P$5 | v15.24,40.64 1.91,40.64 | v10.79,9.53 10.79,17.14
GND  (via drill 0.6)
  Top 0.254: GND.1 v50.8,17.14
  Top 0.305: U4.14 58.74,38.23 C16.2 | 60.01,24.45 60.33,24.13 | U4.5 60.01,31.43 58.42,29.84 58.42,28.57 59.69,27.3 v59.69,24.13 | v14.61,66.04 12.55,66.04 T3.2 11.74,65.72 11.12,65.09 R31.1 5.71,65.09 | R30.1 5.71,65.09 | T5.2 5.39,68.27 5.71,67.94 5.71,65.09 | v41.91,77.47 R28.1 R29.1 T4.2
  Top 0.406: v16.51,37.47 13.97,37.47 U1.2 13.97,34.29 v14.61,34.29 | v55.88,66.04 55.88,66.67 U2.2 59.05,66.67 v59.05,64.14 | v13.34,49.53 13.97,50.16 U3.2 13.97,52.7 v16.51,52.7 | 31.11,74.3 30.17,75.24 IC1.15 25.73,75.24 IC1.21 | IC1.9 25.14,73.29 v24.13,72.39 | IC1.2 23.76,77.84 24.77,76.83 24.77,76.2 IC1.21 | IC1.13 26.39,73.94 25.4,74.93 IC1.21 | AGND.1 4.45,80.64 5.08,80.01 v5.08,77.47
  Top 0.61: CN3.P$2 17.78,11.43 18.41,10.79 22.23,10.79 | 22.23,10.79 30.48,10.79 32.38,12.7 | CN3.P$1 21.98,11.04 22.23,10.79
  Top 0.813: C51.2 40.01,92.71 | C48.2 42.55,92.71 | C23.2 52.07,46.35 | 52.07,46.35 v52.7,45.72 Q1.1 | v52.7,46.99 52.07,46.35 | D2.A 61.89,46.06 62.87,45.09 v62.87,43.81 | v61.59,43.81 D2.A | v60.33,43.81 60.33,45.09 60.96,45.72 61.26,45.72 D2.A | C16.2 54.61,38.23 | 54.61,38.23 54.48,38.23 v53.98,38.73 | v53.98,37.47 53.98,37.59 54.61,38.23
  Top 1.016: C22.2 C23.2
  Top 1.27: CN3.P$3 11.64,14.19 9.53,12.06 4.45,12.06 3.68,12.83 C27.2 C28.2 2.54,17.14 1.91,17.78 1.91,22.86 2.54,23.5 12.06,23.5 15.24,26.67 20.32,26.67 20.95,27.3 20.95,30.48 20.32,31.11 | CN2.P$2 32.38,12.7 33.66,11.43 40.64,11.43 41.27,12.06 41.27,20.32 40.01,21.59 C33.2 C32.2 38.87,29.21 v39.37,29.21 | CN2.P$3 26.45,14.19 25.4,15.24 25.4,22.23 25.91,22.73 C35.2 C34.2 25.4,27.3 23.5,29.21 23.5,45.72 22.86,46.35 20.32,46.35
  Top 1.778: 25.4,74.93 25.4,71.75
  Bottom 0.61: v59.69,24.13 59.69,27.3 61.59,29.21 | v39.37,74.93 v39.37,77.47 36.83,80.01 36.83,86.36 38.1,87.63 52.07,87.63 52.7,88.27 v52.7,88.9
  Bottom 0.813: 53.98,67.31 52.7,67.31 52.07,66.67 52.07,60.96 51.44,60.33 41.91,60.33 37.47,55.88 37.47,48.26 40.64,45.09 40.64,30.48 v39.37,29.21
  Bottom 1.422: v20.95,35.56 22.86,35.56 23.5,36.2 23.5,40.01 24.13,40.64 28.57,40.64 31.11,43.18 v31.11,52.07
  Bottom 1.778: CN2.P$1 41.49,14.19 45.09,17.78 45.09,46.99 41.91,50.16 41.91,53.98 43.81,55.88 67.94,55.88 68.58,56.52 68.58,87.63 66.67,89.53 64.14,89.53 | 48.26,51.44 v45.72,51.44 v44.45,51.44 | 48.26,52.7 v45.72,52.7 v44.45,52.7
  other vias: 13.34,34.29 16.51,36.2 16.51,38.73 12.06,34.29 10.79,34.29 60.33,64.14 57.78,64.14 55.88,69.85 55.88,68.58 55.88,67.31 10.79,49.53 12.06,49.53 14.61,49.53 16.51,53.98 16.51,51.44 63.5,36.83 63.5,35.56 63.5,34.29 52.07,33.02 52.07,31.75 52.07,30.48 52.07,29.21 47.62,88.9 46.35,88.9 45.09,88.9 45.09,90.17 46.35,90.17 47.62,90.17 40.01,92.08 41.27,92.08 42.55,92.08 43.81,92.08 43.81,90.81 42.55,90.81 41.27,90.81 40.01,90.81 52.7,90.17 53.98,90.17 55.24,90.17 56.52,90.17 57.78,90.17 59.05,90.17 59.05,88.9 57.78,88.9 56.52,88.9 55.24,88.9 53.98,88.9 59.05,91.44 59.05,92.71 57.78,92.71 57.78,91.44 56.52,91.44 56.52,92.71 55.24,92.71 55.24,91.44 25.4,72.39 26.67,72.39 24.13,69.85 25.4,69.85 26.67,69.85 36.2,63.5 36.2,61.59 34.29,61.59 32.38,61.59 32.38,66.04 15.24,61.59 16.51,66.04 17.14,61.59 19.05,61.59 20.95,61.59 22.86,61.59 24.77,61.59 26.67,61.59 28.57,67.94 39.37,73.66 39.37,72.39 39.37,76.2 39.37,78.74 41.91,78.74 41.91,76.2 41.91,74.93 41.91,73.66 41.91,72.39 64.14,88.9 65.41,88.9 65.41,90.17 64.14,90.17 50.16,22.86 50.16,21.59 51.44,21.59 51.44,22.86 50.16,26.67 51.44,26.67 20.95,50.8 18.41,50.8 20.95,48.9 18.41,33.66 18.41,35.56 31.11,50.8 18.41,66.04 28.57,66.04 30.48,66.04 30.48,61.59 28.57,61.59 3.81,63.5 3.81,61.59 5.71,61.59 7.62,61.59 9.53,61.59 11.43,61.59 13.34,61.59 24.13,68.58 25.4,68.58 26.67,68.58 20.32,66.04 22.23,66.04 22.23,67.94 24.13,67.31 25.4,67.31 26.67,67.31 26.67,66.04 25.4,66.04 24.13,66.04 7.62,63.5 20.95,46.99 18.41,48.9 20.95,33.66 20.95,31.75 9.53,34.29 9.53,49.53 56.52,60.96 54.61,60.96 54.61,62.87 56.52,62.87 55.88,71.12
  pour Top (isolate 0.305): 37.47,88.27 66.04,88.27 66.04,93.34 37.47,93.34
  pour Top (isolate 0.305): 8.89,31.75 8.89,34.92 15.24,34.92 15.24,31.75
  pour Top (isolate 0.305): 16.51,30.48 16.51,34.92 15.24,34.92 15.24,39.37 21.59,39.37 21.59,30.48
  pour Bottom (isolate 0.305): 22.86,40.01 8.89,40.01 8.89,28.57 22.86,28.57
  pour Top (isolate 0.305): 53.34,71.75 56.52,71.75 56.52,65.41 53.34,65.41
  pour Top (isolate 0.305): 52.07,64.14 56.52,64.14 56.52,65.41 60.96,65.41 60.96,59.05 52.07,59.05
  pour Bottom (isolate 0.305): 64.14,60.33 64.14,71.75 53.34,71.75 53.34,60.33
  pour Top (isolate 0.305): 16.51,45.72 16.51,50.16 15.24,50.16 15.24,54.61 21.59,54.61 21.59,45.72
  pour Top (isolate 0.305): 8.89,46.99 8.89,50.16 15.24,50.16 15.24,46.99
  pour Bottom (isolate 0.305): 22.86,55.24 8.89,55.24 8.89,45.72 22.86,45.72
  pour Top (isolate 0.305): 62.87,37.47 66.67,37.47 66.67,33.66 62.87,33.66
  pour Top (isolate 0.305): 49.53,20.95 53.34,20.95 53.34,33.66 49.53,33.66
  pour Top (isolate 0.305): 53.98,24.77 66.04,24.77 66.04,22.86 53.98,22.86
  pour Bottom (isolate 0.305): 46.99,28.57 64.77,28.57 64.77,53.98 46.99,53.98
  pour Bottom (isolate 0.305): 61.59,16.51 78.74,16.51 78.74,37.47 64.14,37.47 64.14,22.86 61.59,22.86
  pour Bottom (isolate 0.305): 58.42,16.51 58.42,22.86 53.34,22.86 53.34,28.57 49.53,28.57 49.53,16.51
  pour Top (isolate 0.305): 30.48,79.38 43.81,79.38 43.81,71.75 33.02,71.75 30.48,74.3
  pour Bottom (isolate 0.305): 38.73,88.27 69.22,88.27 69.22,93.34 38.73,93.34
  pour Top (isolate 0.305): 23.5,73.03 27.3,73.03 27.3,68.58 36.83,68.58 36.83,60.96 3.17,60.96 3.17,69.85 23.5,69.85
  pour Bottom (isolate 0.305): 3.17,60.96 3.17,78.74 27.94,78.74 27.94,70.48 46.35,70.48 46.35,60.96
  pour Bottom (isolate 0.305): 43.81,71.75 43.81,78.74 31.11,78.74 29.84,77.47 29.84,71.75
  pour Bottom (isolate 0.305): 63.5,49.53 78.74,49.53 78.74,93.34 63.5,93.34 63.5,88.27 70.48,88.27 70.48,53.98 63.5,53.98
  pour Top: 43.81,50.16 46.35,50.16 46.35,59.05 53.34,59.05 53.34,60.96 43.81,60.96
  pour Top: 46.35,50.16 24.13,50.16 22.86,48.9 20.95,48.9 20.95,51.44 22.86,51.44 24.13,52.7 46.35,52.7
IMON
  Top 0.254: IMON.1 53.34,5.71 53.98,6.35 53.98,21.59 54.61,22.23 66.67,22.23 67.31,22.86 67.31,26.04 66.67,26.67 64.45,26.67 C19.1
  Top 0.305: U4.8 61.91,33.34 62.23,33.02 62.87,33.02 64.14,31.75 C19.1
LVL  (via drill 0.6)
  Top 0.305: R29.2 T4.1 46.82,72.86 v46.99,73.03
  Top 0.406: LVL.1 45.72,5.08 45.09,5.71 40.64,5.71 39.37,4.45 17.14,4.45 16.51,5.08 16.51,8.89 v15.88,9.53
  Bottom 0.406: v46.99,73.03 46.99,66.67 43.81,63.5 40.64,63.5 34.29,57.15 34.29,43.18 31.75,40.64 31.75,25.4 29.84,23.5 23.5,23.5 21.98,21.98 CN3.P$6 21.98,18.17 20.95,17.14 17.14,17.14 15.88,15.88 v15.88,9.53
N$1
  Top 0.61: C5.1 10.79,36.21 U1.1
N$2
  Top 0.61: C5.2 12.24,39.5 U1.6
  Top 1.422: L1.2 5.08,39.5 C5.2
N$3
  Top 0.406: U1.3 14.92,35.88 15.88,34.92 R13.2 16.19,30.48 16.51,30.48 18.09,28.89 R14.2
N$4
  Top 0.61: U2.1 57.78,67.64 57.78,69.85 C10.1
N$5
  Top 0.61: U2.6 61.09,68.41 C10.2
  Top 1.422: L2.2 61.09,75.56 C10.2
N$6
  Top 0.406: U2.3 57.47,65.72 56.52,64.77 R15.2 52.38,64.45 50.48,62.55 R16.2
N$7
  Top 0.61: U3.1 11.29,51.45 C15.1
N$8
  Top 0.61: U3.6 12.24,54.74 C15.2
  Top 1.27: C15.2 5.08,54.74 L3.2
N$9
  Top 0.406: R18.2 18.09,44.13 17.14,45.09 arc16 R17.2 15.88,50.16 14.92,51.12 U3.3
N$10  (via drill 0.6)
  Top 0.305: U4.16 54.05,39.93 v53.98,40.01 | Q2.4 50.7,34.19 v50.8,34.29
  Bottom 0.305: v50.8,34.29 50.8,39.37 51.44,40.01 v53.98,40.01
N$11
  Top 0.406: R20.2 51.12,37.15 50.8,37.47 50.8,38.73 50.16,39.37 49.53,39.37 49.53,38.1 49.27,37.84 R19.1 49.23,36.87 Q2.5
N$12
  Top 0.305: U4.13 59.37,44.76 Q1.4
N$13
  Top 0.305: U4.15 58.1,43.5 57.78,43.81 56.52,43.81 55.88,44.45 Q1.2
N$14  (via drill 0.6)
  Top 1.422: R25.1 v46.99,15.24
  Bottom 1.422: v46.99,15.24 48.05,14.19 CN1.P$3
N$15
  Top 1.27: L5.2 6.48,19.09 C28.1 C27.1 8.6,14.61 CN3.P$4
N$16  (via drill 0.6)
  Top 0.305: U4.11 60.64,40.96 61.59,41.91 v61.59,42.55 | v56.52,41.27 52.39,41.27 C17.1
  Top 0.406: C17.1 R20.1
  Bottom 0.305: v56.52,41.27 60.96,41.27 61.59,41.91 v61.59,42.55
N$17
  Top 0.305: C18.1 61.59,27.3 62.23,27.94 R23.1
N$18
  pour Top (isolate 0.305): 54.61,50.16 64.14,50.16 64.14,42.55 67.94,42.55 67.94,53.34 54.61,53.34
N$19
  Top 0.305: U4.9 61.91,39.05 62.23,38.73 63.5,38.73 64.14,39.37 73.66,39.37 74.93,38.1 74.93,37.47 76.83,37.47 77.09,37.2 R21.1
  Top 1.27: L4.2 77.09,44.09 R21.1
N$20
  Top 0.305: R22.2 57.78,30.48 59.37,32.07 U4.4
N$21
  Top 0.305: U4.7 61.28,32.07 62.23,31.11 R23.2
N$22
  Top 0.305: R28.2 47.62,77.47 48.26,76.83 48.26,71.12 47.8,70.66 T4.3 45.4,69.7 R11.1
N$23  (via drill 0.6)
  Top 0.305: U4.6 60.64,30.8 59.69,29.84 v59.69,29.21 | R24.1 v54.61,29.21
  Bottom 0.305: v54.61,29.21 v59.69,29.21
N$24
  Top 1.27: CN2.P$4 28.7,20.11 C35.1 C34.1 28.7,29.89 L6.2
N$25
  Top 0.305: T3.1 9.7,66.99 R31.2 R32.1 7.3,69.85 6.99,69.85 5.25,71.58 T5.3
N$26
  Top 1.27: CN2.P$5 34.16,21.46 C33.1 C32.1 34.16,29.89 L7.2
N$31  (via drill 0.6)
  Top 0.305: IC1.18 32.66,77.19 33.02,76.83 35.56,76.83 35.56,79.38 34.61,80.33 C41.2
  other vias: 30.48,93.34 30.48,92.08 30.48,90.81 30.48,89.53 30.48,88.27 30.48,87 30.48,85.72 30.48,84.45 28.57,84.45 27.3,84.45 27.3,80.64 28.57,83.19 27.3,83.19 28.57,81.92 27.3,81.92 19.68,82.55 17.78,82.55 25.4,80.64 23.5,80.64 21.59,80.64 19.68,80.64 17.78,80.64 15.88,80.64 15.88,82.55 21.59,82.55 23.5,82.55 25.4,82.55 28.57,80.64
  pour Top (isolate 0.305): 15.24,85.09 26.67,85.09 26.67,87 29.84,87 29.84,93.98 34.92,93.98 34.92,87.63 32.38,87.63 32.38,80.01 15.24,80.01
  pour Bottom (isolate 0.305): 15.24,80.01 37.47,80.01 37.47,93.98 29.84,93.98 29.84,85.72 15.24,85.72
N$32
  Top 0.305: IC1.20 31.68,78.49 C41.1 33.79,78.42 D1.C
N$34  (via drill 0.6)
  Top 0.305: v32.38,99.06 32.38,98.42 31.75,97.79 30.48,97.79 30.48,96.78 R1.2 | R2.2 9.85,79.69 10.16,80.01 13.34,80.01 13.97,80.64 13.97,97.79 13.34,98.42 v12.7,98.42
  Top 0.406: R4.1 28.57,95.25
  Top 1.676: R1.2 27.94,96.52
  Bottom 0.305: v12.7,98.42 31.75,98.42 v32.38,99.06
  pour Top (isolate 0.305): 15.24,91.44 26.67,91.44 26.67,94.61 28.57,94.61 28.57,98.42 15.24,98.42
N$35
  Top 1.016: C38.1 R4.2
N$37
  Top 0.305: IC1.3 15.52,77.19 14.93,77.78 C37.2 13.02,77.78 12.7,78.11 R2.1
N$38
  Top 0.305: IC1.4 15.58,76.54 14.93,75.89 C37.1 13.02,75.89 12.7,75.56 R3.1
N$39  (via drill 0.6)
  Top 0.305: T2.4 v30.49,82.54 v30.48,82.55 | IC1.19 27.57,77.84 v26.67,78.74
  Bottom 0.305: v30.49,82.54 30.49,80.02 29.84,79.38 27.3,79.38 v26.67,78.74
N$40  (via drill 0.6)
  Top 0.305: T1.4 37.7,94.22 v38.1,94.61 | IC1.16 31.43,75.89 31.75,75.56 34.29,75.56 v34.92,74.93
  Bottom 0.305: v38.1,94.61 37.47,93.98 37.47,88.27 35.56,86.36 35.56,75.56 v34.92,74.93
N$41
  Top 0.406: IC1.5 17.47,75.89 15.88,74.3
  Top 0.61: C39.2 14.61,71.75
  pour Top (isolate 0.305): 13.34,74.3 13.34,76.83 21.59,76.83 21.59,74.93 19.05,74.93 15.88,71.75 15.88,70.48 11.43,70.48 11.43,74.3
N$42
  Top 0.305: IC1.17 32.05,76.54 32.38,76.2 36.83,76.2 | 36.83,76.2 36.96,76.2 C40.1 | D1.A 37.01,76.38 36.83,76.2
N$43  (via drill 0.6)
  Top 0.305: R7.2 16.51,70.48 v17.78,71.75 17.78,73.66 19.36,75.24 IC1.6 | v13.34,71.12 R6.1 11.74,70 T3.3
  Bottom 0.305: v13.34,71.12 17.14,71.12 v17.78,71.75
N$44
  Top 0.305: IC1.12 29.58,73.29 30.48,72.39 R8.2
N$45
  Top 0.305: R9.2 20.32,73.66 20.6,73.94 IC1.8
N$46
  Top 0.305: IC1.7 19.98,74.59 19.05,73.66 19.05,71.12 18.41,70.48 C42.2
N$47
  Top 0.305: IC1.14 29.55,74.59 32.38,71.75 C43.2
N$48  (via drill 0.6)
  Top 0.305: C49.2 R10.1 39.37,70.17 39.37,69.85 40.95,68.27 C50.2 | IC1.10 22.52,71.41 v22.23,71.12 | v36.2,66.04 40.01,66.04 40.95,66.99 C50.2 | C50.2 R11.2
  Bottom 0.305: v22.23,71.12 34.29,71.12 36.2,69.22 v36.2,66.04
N$49
  Top 0.305: C50.1 R12.2
N$50  (via drill 0.6)
  Top 0.305: C49.1 R12.1 34.61,66.36 v34.29,66.04 | IC1.11 28.29,70.14 v28.57,69.85
  Bottom 0.305: v28.57,69.85 33.66,69.85 34.29,69.22 v34.29,66.04
VAMP  (via drill 0.6)
  Top 0.406: R10.2 41.91,70.48 v42.55,69.85
  Bottom 0.406: v42.55,69.85 43.81,69.85 44.45,70.48 44.45,77.47 45.09,78.11 49.53,78.11 50.16,78.74 50.16,81.28
  Bottom 1.778: CN2.P$6 41.27,19.68 42.55,20.95 42.55,45.72 39.37,48.9 39.37,55.24 42.55,58.42 65.41,58.42 66.04,59.05 66.04,80.01 64.77,81.28
  other vias: 39.37,84.45 40.64,84.45 41.91,84.45 43.18,84.45 44.45,84.45 44.45,83.19 43.18,83.19 41.91,83.19 40.64,83.19 39.37,83.19 39.37,81.92 40.64,81.92 41.91,81.92 43.18,81.92 44.45,81.92 47.62,80.64 47.62,81.92 47.62,83.19 47.62,84.45 52.7,84.45 52.7,83.19 52.7,81.92 52.7,80.64 49.53,85.09 50.8,85.09 59.05,80.64 59.05,81.92 59.05,83.19 59.05,84.45 60.96,85.09 62.23,85.09 64.14,80.64 64.14,81.92 64.14,83.19 64.14,84.45 46.35,80.64 46.35,81.92 46.35,83.19 46.35,84.45 53.98,80.64 53.98,81.92 53.98,83.19 53.98,84.45 57.78,84.45 57.78,83.19 57.78,81.92 57.78,80.64 65.41,80.64 65.41,81.92 65.41,83.19 65.41,84.45 39.37,80.64 40.64,80.64 41.91,80.64 43.18,80.64 44.45,80.64
  pour Top (isolate 0.305): 34.92,80.01 69.22,80.01 69.22,87 37.47,87 37.47,85.09 34.92,85.09
  pour Bottom (isolate 0.305): 38.1,80.01 66.67,80.01 66.67,87 38.1,87
VBUS  (via drill 0.6)
  Top 0.305: U4.12 60.01,42.23 v60.33,42.55 | C17.2 55.56,43.49 v56.52,42.55 | v33.66,99.06 33.66,98.42 34.29,97.79 35.56,97.79 35.56,96.78 R1.1 | R3.2 9.53,75.56 8.26,76.83 8.26,79.38 9.53,80.64 12.7,80.64 13.34,81.28 13.34,96.52 v12.7,97.16 | R32.2 7.62,71.75 8.89,73.03
  Top 0.406: U2.4 61.91,65.72 62.23,66.04 | C17.2 51.12,43.49 50.8,43.18 50.8,42.55 50.16,41.91 49.53,41.91 49.53,43.18 49.27,43.44 R19.2 | VBUS.1 5.71,83.19 7.94,80.96
  Top 0.61: U1.5 13.97,41.91 16.64,41.91 C4.1 C3.1 v20.95,42.55 | U2.5 61.59,66.67 62.23,66.04 62.23,63.5 61.73,62.99 C9.1 C8.1 61.73,56.65 60.96,55.88 | U3.5 13.97,57.15 16.64,57.15 C14.1 C13.1 23.36,55.38 v23.5,55.24 | R1.1 v38.1,96.52 | R6.2 R5.2 8.89,73.03 6.99,74.93 6.99,80.01 7.94,80.96 8.89,81.92 11.43,81.92 12.06,82.55 12.06,95.25 10.79,96.52 v10.79,97.79 | v29.21,44.45 43.18,44.45 45.09,46.35 C23.1
  Top 1.422: C23.1 48.13,43.57 R19.2
  Bottom 0.305: v60.33,42.55 v56.52,42.55 | v12.7,97.16 13.97,97.16 14.61,97.79 33.02,97.79 33.66,98.42 v33.66,99.06
  Bottom 0.61: v10.79,97.79 10.79,96.52 11.43,95.89 14.61,95.89 15.24,96.52 v38.1,96.52 | v23.5,55.24 23.5,47.62 24.77,46.35 27.3,46.35 v29.21,44.45 27.3,42.55 v20.95,42.55
  other vias: 67.31,95.25 67.31,96.52 67.31,97.79 68.58,97.79 68.58,96.52 68.58,95.25 63.5,95.25 63.5,96.52 63.5,97.79 62.23,97.79 62.23,96.52 62.23,95.25 55.24,95.25 55.24,96.52 55.24,97.79 56.52,97.79 56.52,96.52 56.52,95.25 51.44,95.25 51.44,96.52 51.44,97.79 48.9,97.79 48.9,96.52 48.9,95.25 45.09,95.25 45.09,96.52 45.09,97.79
  pour Top (isolate 0.305): 53.34,53.34 53.34,48.9 58.42,48.9 58.42,45.72 47.62,45.72 47.62,53.34
  pour Top (isolate 0.305): 36.83,94.61 38.1,94.61 38.1,95.89 44.45,95.89 44.45,94.61 69.22,94.61 69.22,99.06 36.83,99.06
  pour Top (isolate 0.305): 66.67,95.25 67.31,95.25 67.31,88.27 70.48,88.27 70.48,57.15 47.62,57.15 47.62,53.34 53.34,53.34 53.34,54.61 78.11,54.61 78.11,93.34 69.22,93.34 69.22,98.42 66.67,98.42
  pour Bottom (isolate 0.305): 37.47,99.06 69.22,99.06 69.22,94.61 37.47,94.61
VPIN
  Top 0.305: Q2.3 48.59,34.6 48.26,34.92 | Q2.6 48.59,35.25 48.26,34.92 | Q2.7 47.94,35.23 47.62,34.92 47.94,34.62 Q2.2 | Q2.8 47.28,35.22 46.99,34.92 47.28,34.63 Q2.1 | C16.1 50.03,35.43 49.53,34.92 48.26,34.92 | R24.2 54.61,34.16 C16.1 | C16.1 57.04,35.43 U4.1
  Top 0.406: VPIN.1 48.26,12.06 45.09,15.24 45.09,20.32 45.72,20.95 46.58,20.95 R25.2
  Top 0.61: C21.1 46.86,32.52 45.72,33.66 45.72,34.92 46.99,34.92 47.62,34.92 48.26,34.92
  Top 1.016: C20.1 46.86,25.57 C24.+ 46.35,24.77 46.99,24.13 R25.2
  Top 1.422: C20.1 C21.1